# EAGLE schematic firefly-instrument-tray (EAGLE 7.7.0)

## Sheet 1 of 2
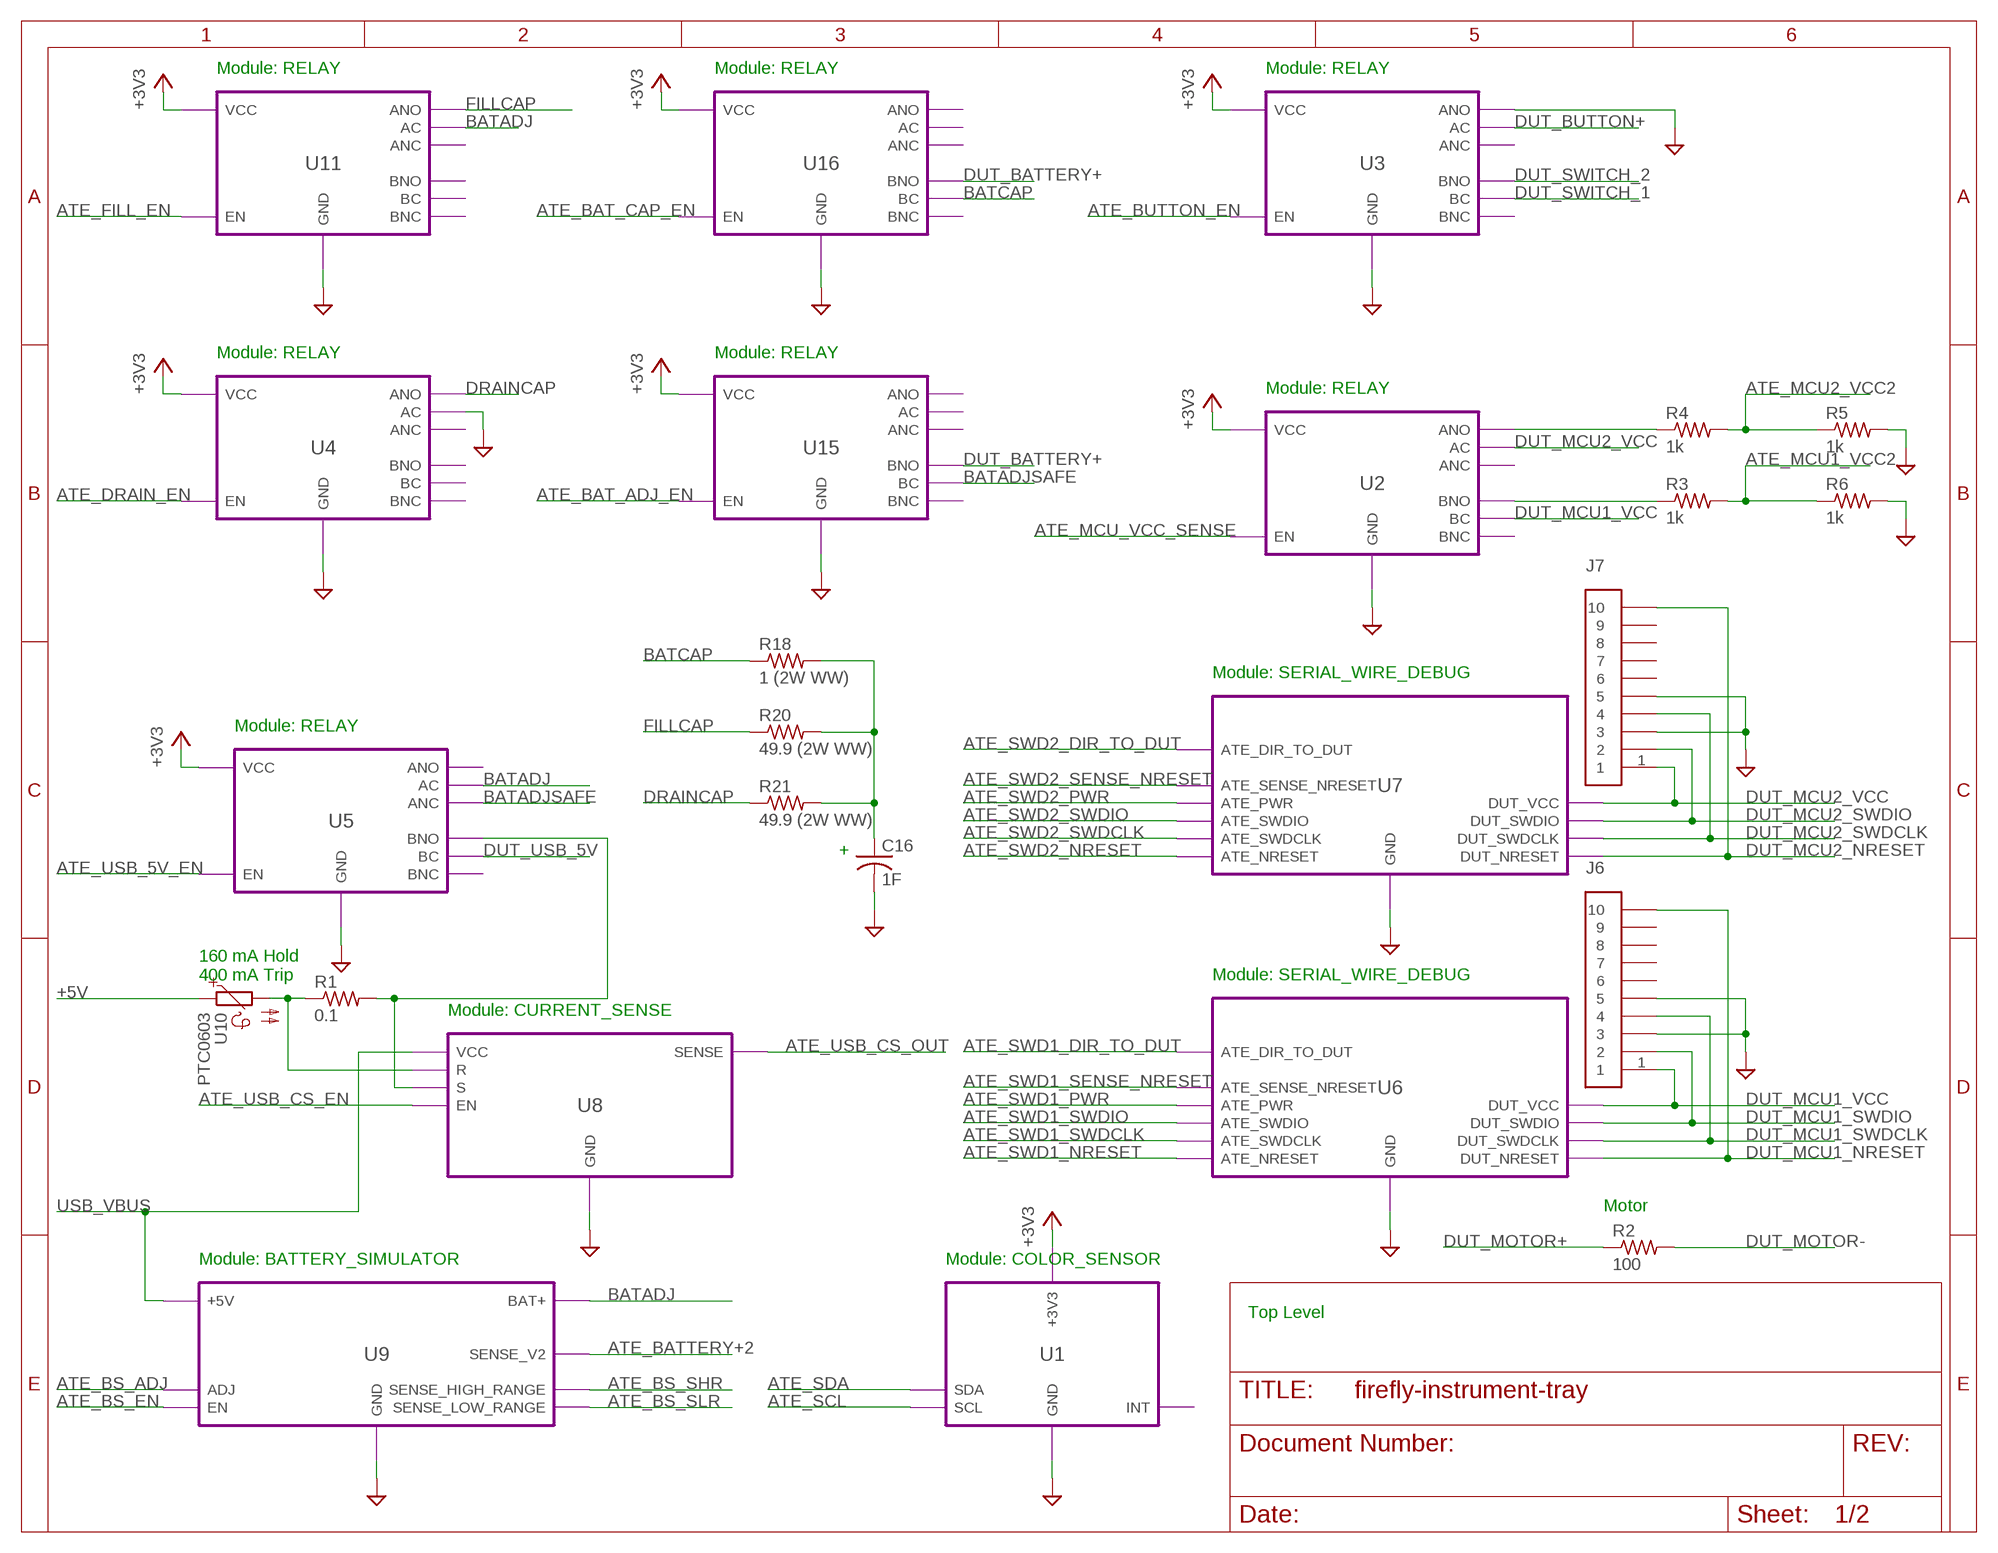
[diagram p0: schematic, sheet 1]

### Parts
C16  1F  C-USPM118  [PM118]
J6  CON-10SWD  [SWD-10]
J7  CON-10SWD  [SWD-10]
R1  0.1  R-USKRL6432  [KRL6432]
R2  100  R-USRW0S6BB  [RW0S6BB]
R3  1k  R-USR0805  [R0805]
R4  1k  R-USR0805  [R0805]
R5  1k  R-USR0805  [R0805]
R6  1k  R-USR0805  [R0805]
R18  1 (2W WW)  R-USRCL1225  [RCL1225]
R20  49.9 (2W WW)  R-USKRL6432  [KRL6432]
R21  49.9 (2W WW)  R-USRCL1225  [RCL1225]
U10  PTC0603  [0603]

### Module instances
U6 = SERIAL_WIRE_DEBUG
U8 = CURRENT_SENSE
U3 = RELAY
U5 = RELAY
U4 = RELAY
U9 = BATTERY_SIMULATOR
U7 = SERIAL_WIRE_DEBUG
U1 = COLOR_SENSOR
U2 = RELAY
U11 = RELAY
U15 = RELAY
U16 = RELAY

### Nets
+3V3: port U3.VCC U5.VCC U4.VCC U1.+3V3 U2.VCC U11.VCC U15.VCC U16.VCC ; also sheet 2
+5V: U10.1 ; also sheet 2
ATE_BAT_ADJ_EN: port U15.EN ; also sheet 2
ATE_BAT_CAP_EN: port U16.EN ; also sheet 2
ATE_BATTERY+2: port U9.SENSE_V2 ; also sheet 2
ATE_BS_ADJ: port U9.ADJ ; also sheet 2
ATE_BS_EN: port U9.EN ; also sheet 2
ATE_BS_SHR: port U9.SENSE_HIGH_RANGE ; also sheet 2
ATE_BS_SLR: port U9.SENSE_LOW_RANGE ; also sheet 2
ATE_BUTTON_EN: port U3.EN ; also sheet 2
ATE_DRAIN_EN: port U4.EN ; also sheet 2
ATE_FILL_EN: port U11.EN ; also sheet 2
ATE_MCU1_VCC2: R3.2 R6.1 ; also sheet 2
ATE_MCU2_VCC2: R4.2 R5.1 ; also sheet 2
ATE_MCU_VCC_SENSE: port U2.EN ; also sheet 2
ATE_SCL: port U1.SCL ; also sheet 2
ATE_SDA: port U1.SDA ; also sheet 2
ATE_SWD1_DIR_TO_DUT: port U6.ATE_DIR_TO_DUT ; also sheet 2
ATE_SWD1_NRESET: port U6.ATE_NRESET ; also sheet 2
ATE_SWD1_PWR: port U6.ATE_PWR ; also sheet 2
ATE_SWD1_SENSE_NRESET: port U6.ATE_SENSE_NRESET ; also sheet 2
ATE_SWD1_SWDCLK: port U6.ATE_SWDCLK ; also sheet 2
ATE_SWD1_SWDIO: port U6.ATE_SWDIO ; also sheet 2
ATE_SWD2_DIR_TO_DUT: port U7.ATE_DIR_TO_DUT ; also sheet 2
ATE_SWD2_NRESET: port U7.ATE_NRESET ; also sheet 2
ATE_SWD2_PWR: port U7.ATE_PWR ; also sheet 2
ATE_SWD2_SENSE_NRESET: port U7.ATE_SENSE_NRESET ; also sheet 2
ATE_SWD2_SWDCLK: port U7.ATE_SWDCLK ; also sheet 2
ATE_SWD2_SWDIO: port U7.ATE_SWDIO ; also sheet 2
ATE_USB_5V_EN: port U5.EN ; also sheet 2
ATE_USB_CS_EN: port U8.EN ; also sheet 2
ATE_USB_CS_OUT: port U8.SENSE ; also sheet 2
BATADJ: port U9.BAT+ U5.AC U11.AC
BATADJSAFE: port U5.ANC U15.BC
BATCAP: R18.1 ; port U16.BC
DRAINCAP: R21.1 ; port U4.ANO
DUT_BATTERY+: port U15.BNO U16.BNO ; also sheet 2
DUT_BUTTON+: port U3.AC ; also sheet 2
DUT_MCU1_NRESET: J6.10 ; port U6.DUT_NRESET ; also sheet 2
DUT_MCU1_SWDCLK: J6.4 ; port U6.DUT_SWDCLK ; also sheet 2
DUT_MCU1_SWDIO: J6.2 ; port U6.DUT_SWDIO ; also sheet 2
DUT_MCU1_VCC: J6.1 ; port U6.DUT_VCC U2.BC ; also sheet 2
DUT_MCU2_NRESET: J7.10 ; port U7.DUT_NRESET ; also sheet 2
DUT_MCU2_SWDCLK: J7.4 ; port U7.DUT_SWDCLK ; also sheet 2
DUT_MCU2_SWDIO: J7.2 ; port U7.DUT_SWDIO ; also sheet 2
DUT_MCU2_VCC: J7.1 ; port U7.DUT_VCC U2.AC ; also sheet 2
DUT_MOTOR+: R2.1 ; also sheet 2
DUT_MOTOR-: R2.2 ; also sheet 2
DUT_SWITCH_1: port U3.BC ; also sheet 2
DUT_SWITCH_2: port U3.BNO ; also sheet 2
DUT_USB_5V: port U5.BC ; also sheet 2
FILLCAP: R20.1 ; port U11.ANO
GND: C16.- J6.3 J6.5 J7.3 J7.5 R5.2 R6.2 ; port U5.GND U4.GND U3.GND U8.GND U9.GND U6.GND U7.GND U1.GND U2.GND U11.GND U15.GND U16.GND U4.AC U3.ANO ; also sheet 2
N$2: R1.2 ; port U5.BNO U8.S
N$3: R1.1 U10.2 ; port U8.R
N$4: C16.+ R18.2 R20.2 R21.2
N$8: R4.1 ; port U2.ANO
N$9: R3.1 ; port U2.BNO
USB_VBUS: port U9.+5V U8.VCC ; also sheet 2
Unconnected: J6.6 J6.7 J6.8 J6.9 J7.6 J7.7 J7.8 J7.9

### Notes on the sheet
- Module: RELAY | Module: RELAY | Module: RELAY
- Module: RELAY | Module: RELAY
- Module: RELAY
- Module: SERIAL_WIRE_DEBUG
- Module: RELAY
- +
- 160 mA Hold
  400 mA Trip
- Module: SERIAL_WIRE_DEBUG
- Module: CURRENT_SENSE
- Motor
- Module: BATTERY_SIMULATOR | Module: COLOR_SENSOR
- Top Level

## Sheet 2 of 2
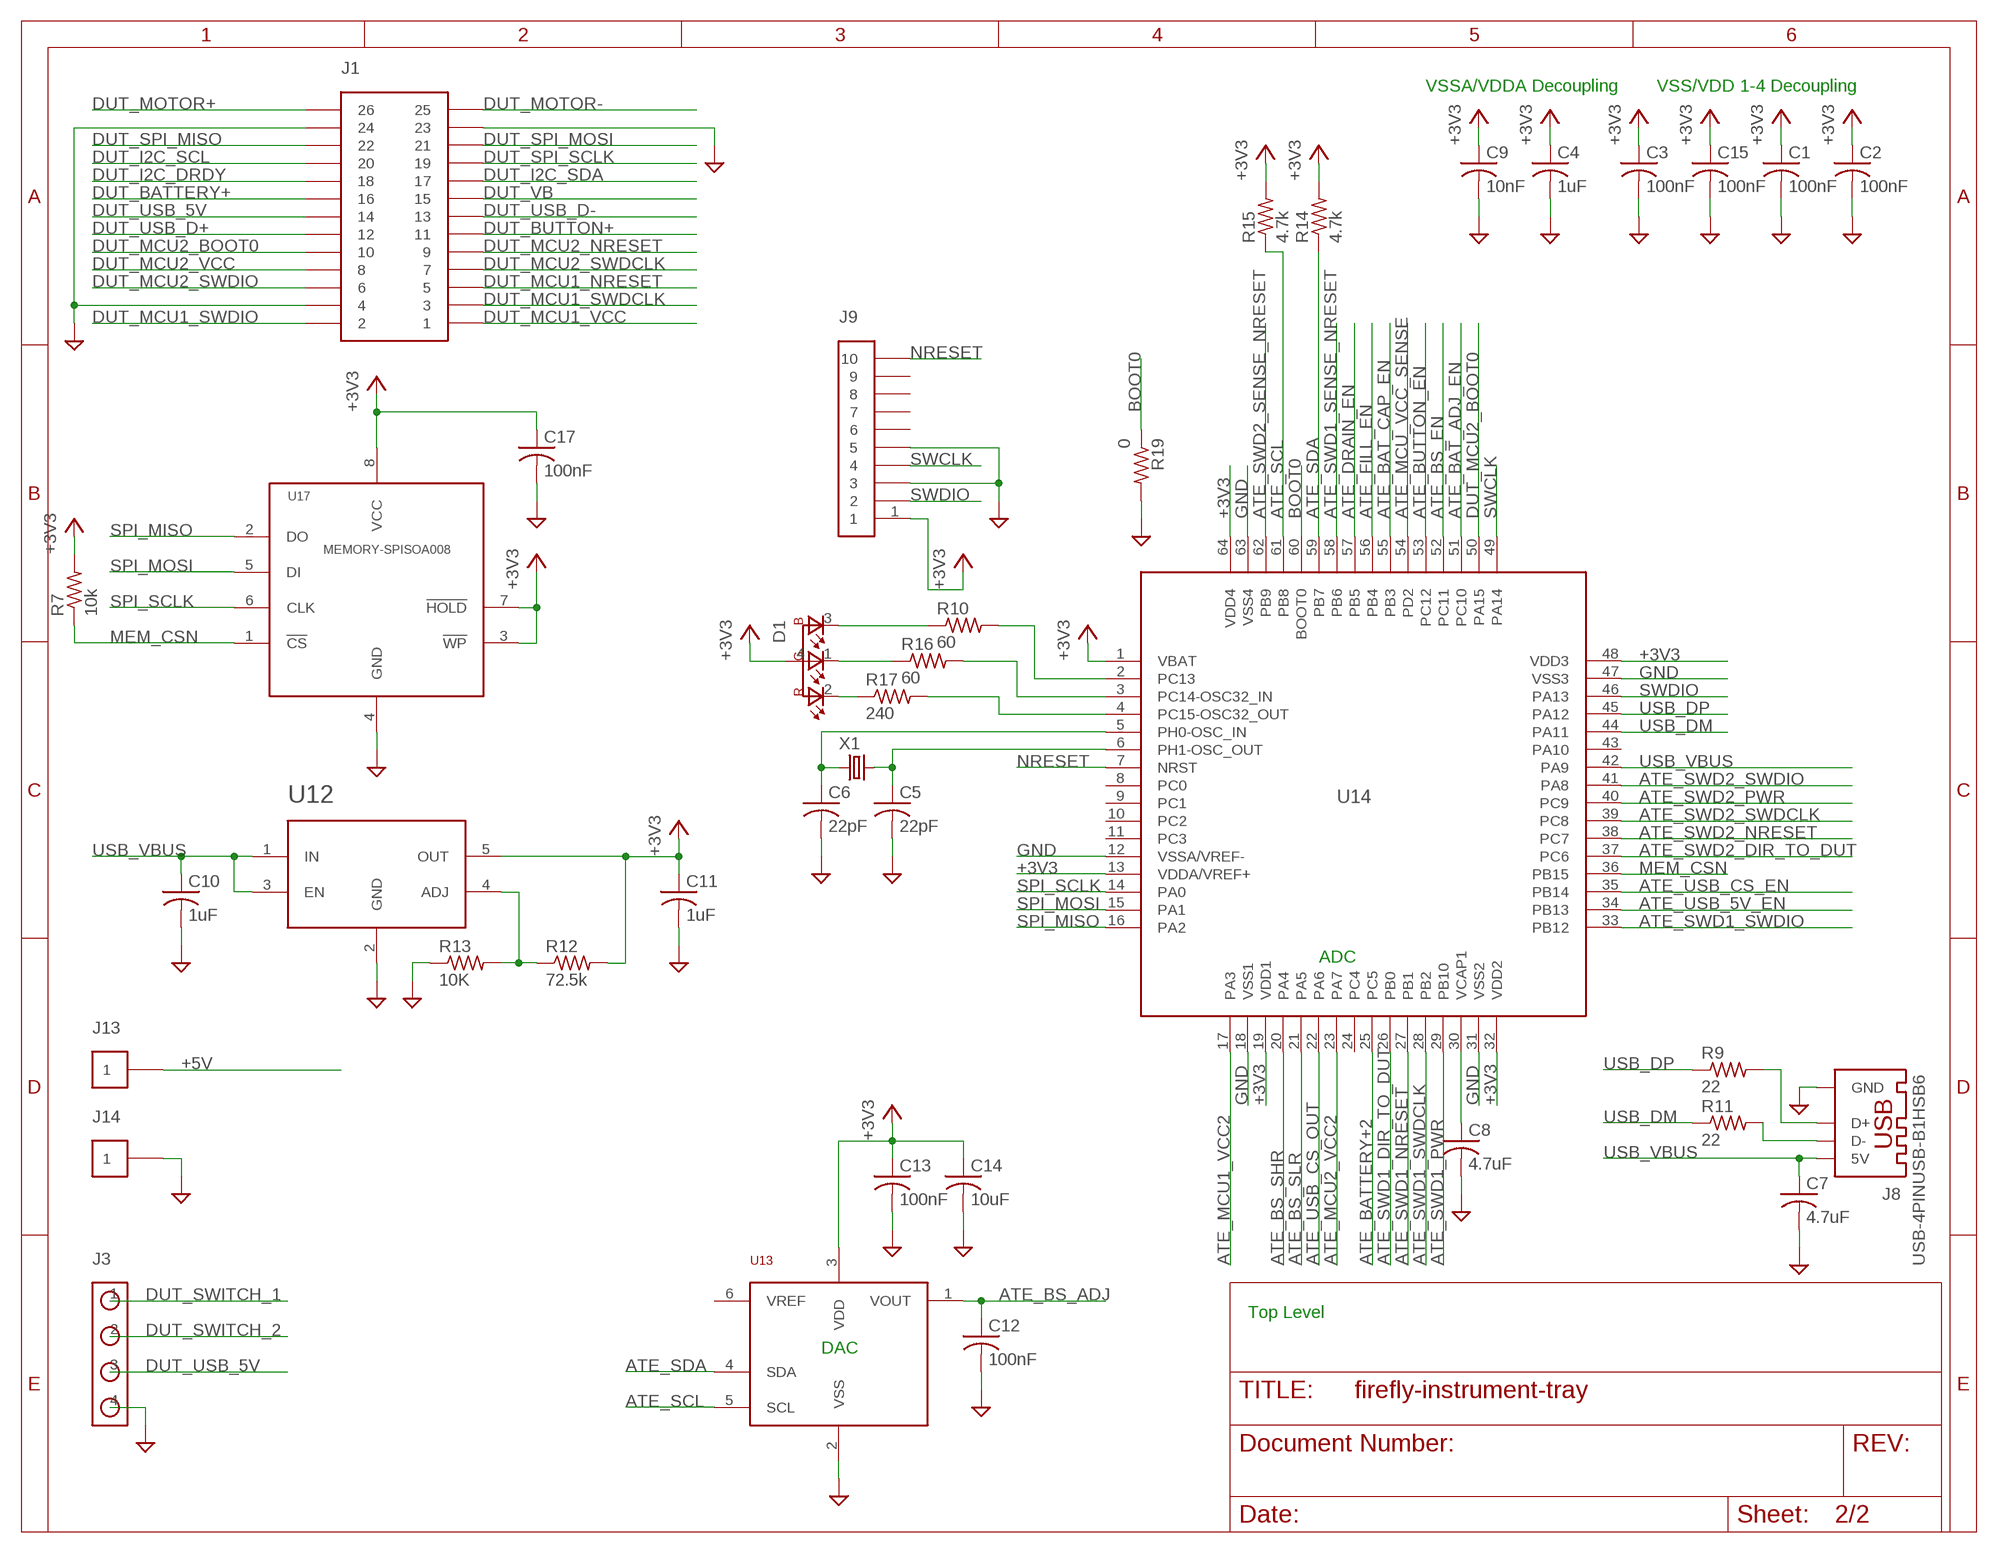
[diagram p1: schematic, sheet 2]

### Parts
C1  100nF  C-USC0805  [C0805]
C2  100nF  C-USC0805  [C0805]
C3  100nF  C-USC0805  [C0805]
C4  1uF  C-USC0805  [C0805]
C5  22pF  C-USC0805  [C0805]
C6  22pF  C-USC0805  [C0805]
C7  4.7uF  C-USC0805  [C0805]
C8  4.7uF  C-USC0805  [C0805]
C9  10nF  C-USC0805  [C0805]
C10  1uF  C-USC0805  [C0805]
C11  1uF  C-USC0805  [C0805]
C12  100nF  C-USC0805  [C0805]
C13  100nF  C-USC0805  [C0805]
C14  10uF  C-USC0805  [C0805]
C15  100nF  C-USC0805  [C0805]
C17  100nF  C-USC0805  [C0805]
D1  LED-RGB-CAMSL0201RGB  [MSL0201RGB]
J1  CON-26  [CON-HEADER-2X13]
J3  CON-4282847-4  [282847-4]
J8  USB-4PINUSB-B1HSB6  [USB-B1HSB6]
J9  CON-10SWD  [SWD-10]
J13  CON-1CT3151  [CT3151]
J14  CON-1CT3151  [CT3151]
R7  10k  R-USR0805  [R0805]
R9  22  R-USR0805  [R0805]
R10  60  R-USR0805  [R0805]
R11  22  R-USR0805  [R0805]
R12  72.5k  R-USR0805  [R0805]
R13  10K  R-USR0805  [R0805]
R14  4.7k  R-USR0805  [R0805]
R15  4.7k  R-USR0805  [R0805]
R16  60  R-USR0805  [R0805]
R17  240  R-USR0805  [R0805]
R19  0  R-USR0805  [R0805]
U12  VREG-ADJAP7331-WG-7  [SOT-23-5]
U13  MCP47X6  [SOT-23-6]
U14  STM32F411-LQFP64  [LQFP-64]
U17  MEMORY-SPISOA008  [SOA008]
X1  XTAL2CX5032GA  [CX5032GA]

### Nets
+3V3: C1.1 C2.1 C3.1 C4.1 C9.1 C11.1 C13.1 C14.1 C15.1 C17.1 D1.4(A) J9.1 R7.2 R12.2 R14.2 R15.2 U12.5(OUT) U13.3(VDD) U14.1(VBAT) U14.13(VDDA/VREF+) U14.19(VDD1) U14.32(VDD2) U14.48(VDD3) U14.64(VDD4) U17.3(!WP) U17.7(!HOLD) U17.8(VCC) ; also sheet 1
+5V: J13.1 J13.2 J13.3 J13.4 ; also sheet 1
ATE_BAT_ADJ_EN: U14.51(PC10) ; also sheet 1
ATE_BAT_CAP_EN: U14.55(PB3) ; also sheet 1
ATE_BATTERY+2: U14.25(PC5) ; also sheet 1
ATE_BS_ADJ: C12.1 U13.1(VOUT) ; also sheet 1
ATE_BS_EN: U14.52(PC11) ; also sheet 1
ATE_BS_SHR: U14.20(PA4) ; also sheet 1
ATE_BS_SLR: U14.21(PA5) ; also sheet 1
ATE_BUTTON_EN: U14.53(PC12) ; also sheet 1
ATE_DRAIN_EN: U14.57(PB5) ; also sheet 1
ATE_FILL_EN: U14.56(PB4) ; also sheet 1
ATE_MCU1_VCC2: U14.17(PA3) ; also sheet 1
ATE_MCU2_VCC2: U14.23(PA7) ; also sheet 1
ATE_MCU_VCC_SENSE: U14.54(PD2) ; also sheet 1
ATE_SCL: R15.1 U13.5(SCL) U14.61(PB8) ; also sheet 1
ATE_SDA: R14.1 U13.4(SDA) U14.59(PB7) ; also sheet 1
ATE_SWD1_DIR_TO_DUT: U14.26(PB0) ; also sheet 1
ATE_SWD1_NRESET: U14.27(PB1) ; also sheet 1
ATE_SWD1_PWR: U14.29(PB10) ; also sheet 1
ATE_SWD1_SENSE_NRESET: U14.58(PB6) ; also sheet 1
ATE_SWD1_SWDCLK: U14.28(PB2) ; also sheet 1
ATE_SWD1_SWDIO: U14.33(PB12) ; also sheet 1
ATE_SWD2_DIR_TO_DUT: U14.37(PC6) ; also sheet 1
ATE_SWD2_NRESET: U14.38(PC7) ; also sheet 1
ATE_SWD2_PWR: U14.40(PC9) ; also sheet 1
ATE_SWD2_SENSE_NRESET: U14.62(PB9) ; also sheet 1
ATE_SWD2_SWDCLK: U14.39(PC8) ; also sheet 1
ATE_SWD2_SWDIO: U14.41(PA8) ; also sheet 1
ATE_USB_5V_EN: U14.34(PB13) ; also sheet 1
ATE_USB_CS_EN: U14.35(PB14) ; also sheet 1
ATE_USB_CS_OUT: U14.22(PA6) ; also sheet 1
BOOT0: R19.1 U14.60(BOOT0)
DUT_BATTERY+: J1.16 ; also sheet 1
DUT_BUTTON+: J1.11 ; also sheet 1
DUT_I2C_DRDY: J1.18
DUT_I2C_SCL: J1.20
DUT_I2C_SDA: J1.17
DUT_MCU1_NRESET: J1.5 ; also sheet 1
DUT_MCU1_SWDCLK: J1.3 ; also sheet 1
DUT_MCU1_SWDIO: J1.2 ; also sheet 1
DUT_MCU1_VCC: J1.1 ; also sheet 1
DUT_MCU2_BOOT0: J1.10 U14.50(PA15)
DUT_MCU2_NRESET: J1.9 ; also sheet 1
DUT_MCU2_SWDCLK: J1.7 ; also sheet 1
DUT_MCU2_SWDIO: J1.6 ; also sheet 1
DUT_MCU2_VCC: J1.8 ; also sheet 1
DUT_MOTOR+: J1.26 ; also sheet 1
DUT_MOTOR-: J1.25 ; also sheet 1
DUT_SPI_MISO: J1.22
DUT_SPI_MOSI: J1.21
DUT_SPI_SCLK: J1.19
DUT_SWITCH_1: J3.1 ; also sheet 1
DUT_SWITCH_2: J3.2 ; also sheet 1
DUT_USB_5V: J1.14 J3.3 ; also sheet 1
DUT_USB_D+: J1.12
DUT_USB_D-: J1.13
DUT_VB: J1.15
GND: C1.2 C2.2 C3.2 C4.2 C5.2 C6.2 C7.2 C8.2 C9.2 C10.2 C11.2 C12.2 C13.2 C14.2 C15.2 C17.2 J1.4 J1.23 J1.24 J3.4 J8.4(GND) J9.3 J9.5 J14.1 J14.2 J14.3 J14.4 R13.1 R19.2 U12.2(GND) U13.2(VSS) U14.12(VSSA/VREF-) U14.18(VSS1) U14.31(VSS2) U14.47(VSS3) U14.63(VSS4) U17.4(GND) ; also sheet 1
MEM_CSN: R7.1 U14.36(PB15) U17.1(!CS)
N$1: R10.2 U14.2(PC13)
N$5: C5.1 U14.6(PH1-OSC_OUT) X1.2
N$6: C6.1 U14.5(PH0-OSC_IN) X1.1
N$7: R16.2 U14.3(PC14-OSC32_IN)
N$10: C8.1 U14.30(VCAP1)
N$11: R12.1 R13.2 U12.4(ADJ)
N$12: J8.2(D-) R11.2
N$13: R17.2 U14.4(PC15-OSC32_OUT)
N$14: J8.3(D+) R9.2
N$15: D1.3(B) R10.1
N$16: D1.1(G) R16.1
N$17: D1.2(R) R17.1
NRESET: J9.10 U14.7(NRST)
SPI_MISO: U14.16(PA2) U17.2(DO)
SPI_MOSI: U14.15(PA1) U17.5(DI)
SPI_SCLK: U14.14(PA0) U17.6(CLK)
SWCLK: J9.4 U14.49(PA14)
SWDIO: J9.2 U14.46(PA13)
USB_DM: R11.1 U14.44(PA11)
USB_DP: R9.1 U14.45(PA12)
USB_VBUS: C7.1 C10.1 J8.1(5V) U12.1(IN) U12.3(EN) U14.42(PA9) ; also sheet 1
Unconnected: J9.6 J9.7 J9.8 J9.9 U13.6(VREF) U14.8(PC0) U14.9(PC1) U14.10(PC2) U14.11(PC3) U14.24(PC4) U14.43(PA10)

### Notes on the sheet
- VSSA/VDDA Decoupling | VSS/VDD 1-4 Decoupling
- ADC
- Top Level
- DAC

## Library data of the parts
C1-C3 C12 C13 C15 C17 = firefly:C-US: CAPACITOR, American symbol; MANUFACTURER: AVX Corporation; ORDERING-CODE: 08055C104KAT2A
C4 C10 C11 = firefly:C-US: CAPACITOR, American symbol; MANUFACTURER: Yageo; ORDERING-CODE: CC0805KKX7R7BB105
C5 C6 = firefly:C-US: CAPACITOR, American symbol; MANUFACTURER: KEMET; ORDERING-CODE: C0805C220F5GACTU
C7 C8 = firefly:C-US: CAPACITOR, American symbol; MANUFACTURER: Murata Electronics North America; ORDERING-CODE: GRM21BR61E475KA12L
C9 = firefly:C-US: CAPACITOR, American symbol; MANUFACTURER: AVX Corporation; ORDERING-CODE: 08055C103KAT2A
C14 = firefly:C-US: CAPACITOR, American symbol; MANUFACTURER: AVX Corporation; ORDERING-CODE: 0805YD106KAT2A
C16 = firefly:C-US: CAPACITOR, American symbol; MANUFACTURER: Eaton; ORDERING-CODE: PM-5R0V105-R
D1 = firefly:LED-RGB-CA; MANUFACTURER: Rohm Semiconductor; ORDERING-CODE: MSL0201RGBW1
J1 = firefly:CON-26; MANUFACTURER: Amphenol FCI; ORDERING-CODE: 68602-126HLF
J3 = firefly:CON-4; MANUFACTURER: TE Connectivity AMP Connectors; ORDERING-CODE: 282847-4
J6 J7 = firefly:CON-10; MANUFACTURER: Harwin; ORDERING-CODE: M50-3500542
J8 = firefly:USB-4PIN; MANUFACTURER: On Shore Technology Inc.; ORDERING-CODE: USB-B1HSB6
J9 = firefly:CON-10; MAUFACTURER: Harwin; ORDERING-CODE: M50-3500542
J13 = firefly:CON-1; MANUFACTURER: B&K Precision; ORDERING-CODE: CT3151-2
J14 = firefly:CON-1; MANUFACTURER: B&K Precision; ORDERING-CODE: CT3151SP-0
R1 = firefly:R-US: RESISTOR, American symbol; MANUFACTURER: Susumu; ORDERING-CODE: KRL6432E-M-R100-F-T1
R2 = firefly:R-US: RESISTOR, American symbol; MANUFACTURER: Ohmite; ORDERING-CODE: RW0S6BB100RFET
R3-R7 R13 = firefly:R-US: RESISTOR, American symbol; MANUFACTURER: Yageo; ORDERING-CODE: RC0805FR-0710KL
R9 R11 = firefly:R-US: RESISTOR, American symbol; MANUFACTURER: Yageo; ORDERING-CODE: RC0805FR-0722RL
R10 R16 = firefly:R-US: RESISTOR, American symbol; MANUFACTURER: Yageo; ORDERING-CODE: RC0805FR-0760R4L
R12 = firefly:R-US: RESISTOR, American symbol; MANUFACTURER: Yageo; ORDERING-CODE: RT0805BRD0773K2L
R14 R15 = firefly:R-US: RESISTOR, American symbol; MANUFACTURER: Yageo; ORDERING-CODE: RC0805FR-074K7L
R17 = firefly:R-US: RESISTOR, American symbol; MANUFACTURER: Yageo; ORDERING-CODE: RC0805FR-07240RL
R18 = firefly:R-US: RESISTOR, American symbol; MANUFACTURER: Vishay Dale; ORDERING-CODE: RCL12251R00FKEG
R19 = firefly:R-US: RESISTOR, American symbol; MANUFACTURER: Yageo; ORDERING-CODE: RC0805FR-070RL
R20 R21 = firefly:R-US: RESISTOR, American symbol; MANUFACTURER: Vishay Dale; ORDERING-CODE: RCL122549R9FKEG
U10 = firefly:PTC; MANUFACTURER: Bel Fuse Inc.; ORDERING-CODE: 0ZCM0016FF2G
U12 = firefly:VREG-ADJ; MANUFACTURER: Diodes Incorporated; ORDERING-CODE: AP7331-WG-7
U13 = firefly:MCP47X6; MANUFACTURER: Microchip Technology; ORDERING-CODE: MCP4726A1T-E/CH
U14 = firefly:STM32F411-LQFP64; MANUFACTURER: STMicroelectronics; ORDERING-CODE: STM32F411RET6
U17 = firefly:MEMORY-SPI; MANUFACTURER: Cypress Semiconductor Corp; ORDERING-CODE: S25FL116K0XMFI043
X1 = firefly:XTAL2; MANUFACTURER: AVX Corp/Kyocera Corp; ORDERING-CODE: CX5032GA08000H0PST02

## Module SERIAL_WIRE_DEBUG
Ports: GND(io) ATE_NRESET(io) ATE_SWDCLK(io) ATE_SWDIO(io) ATE_PWR(io) ATE_DIR_TO_DUT(io) DUT_NRESET(io) DUT_SWDCLK(io) DUT_SWDIO(io) DUT_VCC(io) ATE_SENSE_NRESET(io)
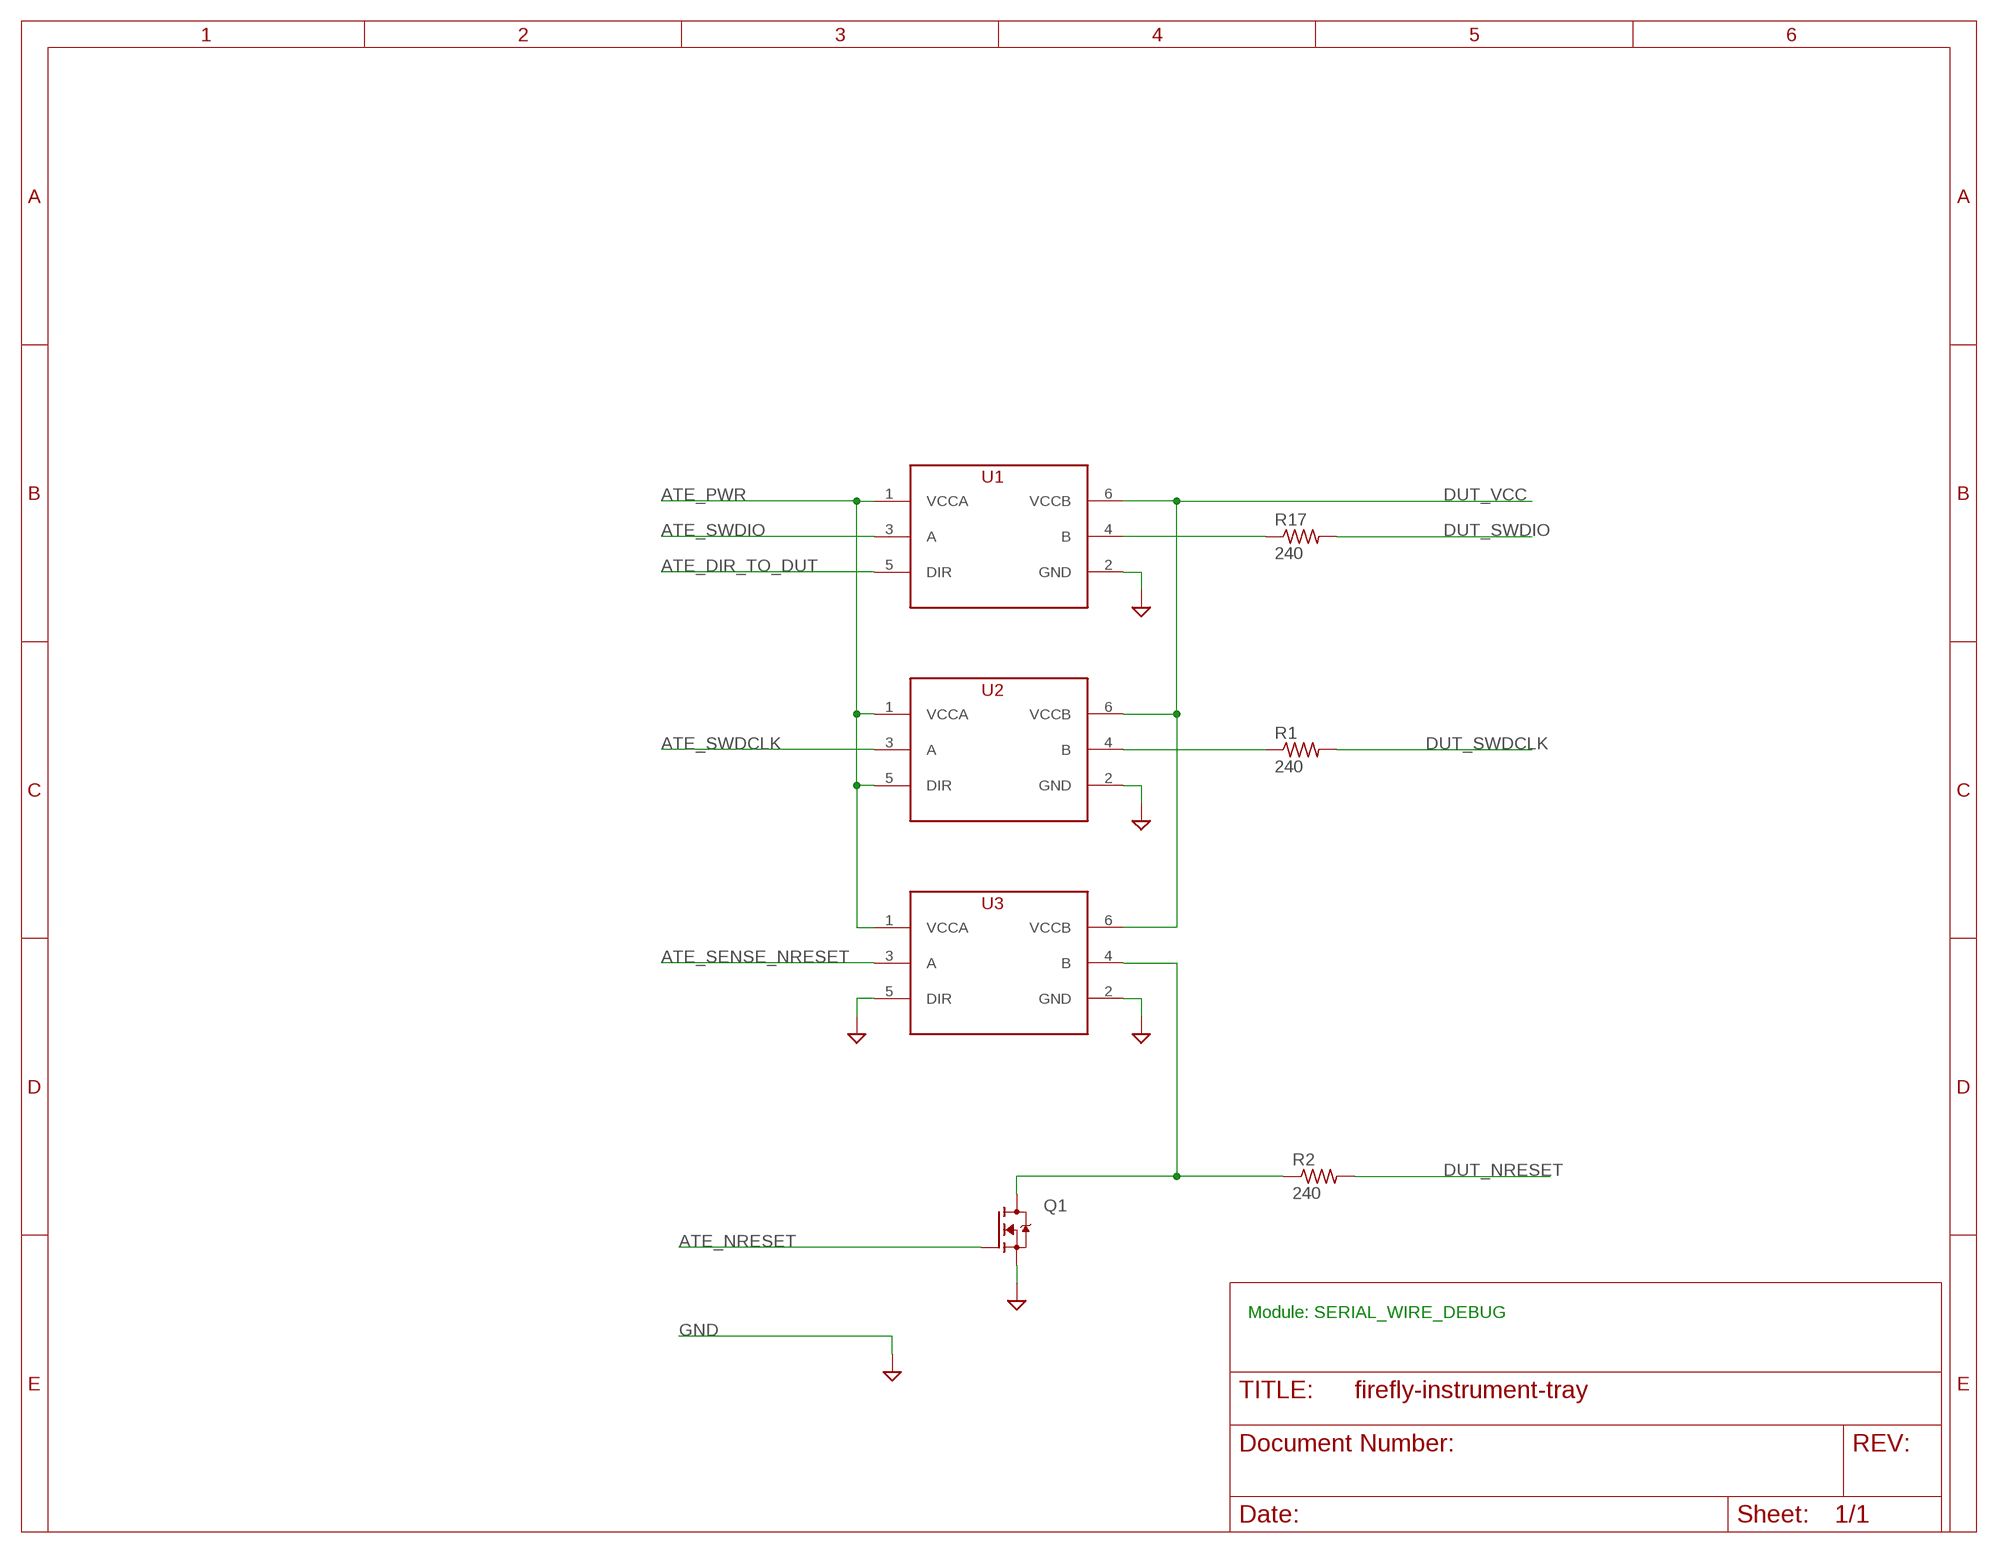
[diagram p2: schematic, module SERIAL_WIRE_DEBUG, sheet 1]

### Parts
Q1  FET-NMCPH3  [MCPH3]
R1  240  R-USR0805  [R0805]
R2  240  R-USR0805  [R0805]
R17  240  R-USR0805  [R0805]
U1  74LVCH1T45  [SOT363]
U2  74LVCH1T45  [SOT363]
U3  74LVCH1T45  [SOT363]

### Nets
ATE_DIR_TO_DUT: U1.5(DIR)
ATE_NRESET: Q1.1(G)
ATE_PWR: U1.1(VCCA) U2.1(VCCA) U2.5(DIR) U3.1(VCCA)
ATE_SENSE_NRESET: U3.3(A)
ATE_SWDCLK: U2.3(A)
ATE_SWDIO: U1.3(A)
DUT_NRESET: R2.2
DUT_SWDCLK: R1.2
DUT_SWDIO: R17.2
DUT_VCC: U1.6(VCCB) U2.6(VCCB) U3.6(VCCB)
GND: Q1.2(S) U1.2(GND) U2.2(GND) U3.2(GND) U3.5(DIR)
N$1: Q1.3(D) R2.1 U3.4(B)
N$2: R17.1 U1.4(B)
N$3: R1.1 U2.4(B)

### Notes on the sheet
- Module: SERIAL_WIRE_DEBUG

### Library data of the parts
Q1 = firefly:FET-N; MANUFACTURER: ON Semiconductor; ORDERING-CODE: MCH3481-TL-W
R1 R2 R17 = firefly:R-US: RESISTOR, American symbol; MANUFACTURER: Yageo; ORDERING-CODE: RC0805FR-07240RL
U1-U3 = firefly:74LVCH1T45; MANUFACTURER: NXP Semiconductors; ORDERING-CODE: 74LVCH1T45GW,125

## Module RELAY
Ports: GND(io) VCC(io) ANO(io) AC(io) ANC(io) BNO(io) BC(io) BNC(io) EN(io)
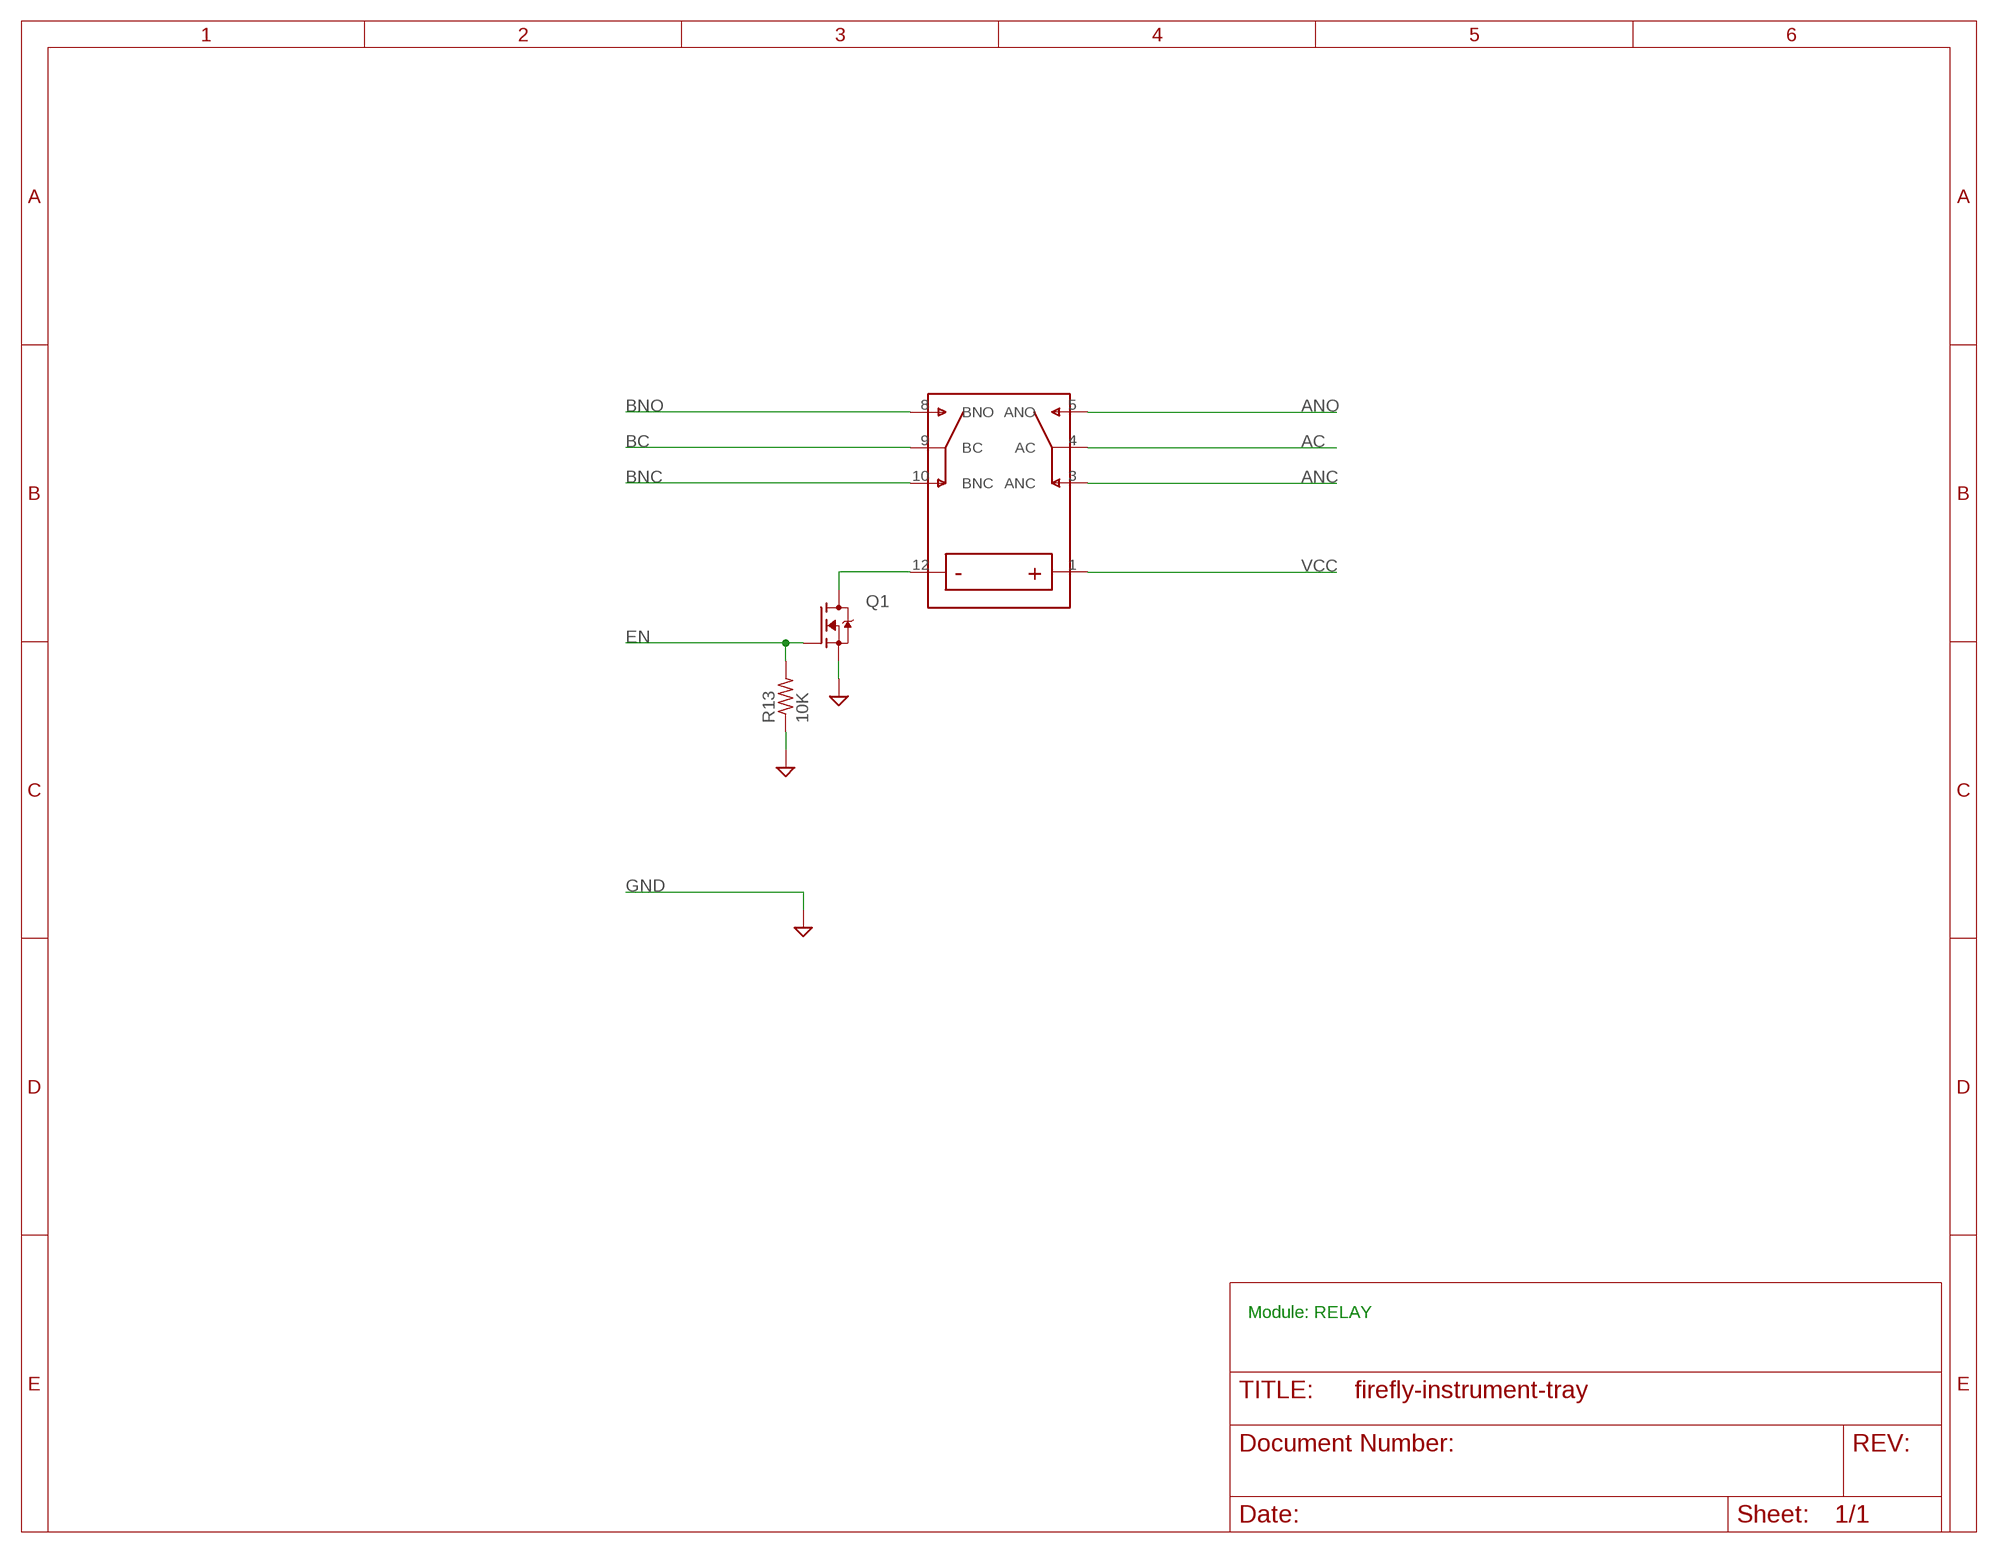
[diagram p3: schematic, module RELAY, sheet 1]

### Parts
Q1  FET-NMCPH3  [MCPH3]
R13  10K  R-USR0805  [R0805]
U1  TXS2SA  [TXS2SA]

### Nets
AC: U1.4(AC)
ANC: U1.3(ANC)
ANO: U1.5(ANO)
BC: U1.9(BC)
BNC: U1.10(BNC)
BNO: U1.8(BNO)
EN: Q1.1(G) R13.2
GND: Q1.2(S) R13.1
N$2: Q1.3(D) U1.12(-)
VCC: U1.1(+)

### Notes on the sheet
- Module: RELAY

### Library data of the parts
Q1 = firefly:FET-N; MANUFACTURER: ON Semiconductor; ORDERING-CODE: MCH3481-TL-W
R13 = firefly:R-US: RESISTOR, American symbol; MANUFACTURER: Yageo; ORDERING-CODE: RC0805FR-0710KL
U1 = firefly:TXS2SA; MANUFACTURER: Panasonic Electric Works; ORDERING-CODE: TXS2SA-3V-Z

## Module CURRENT_SENSE
Ports: GND(io) VCC(io) R(io) S(io) EN(io) SENSE(io)
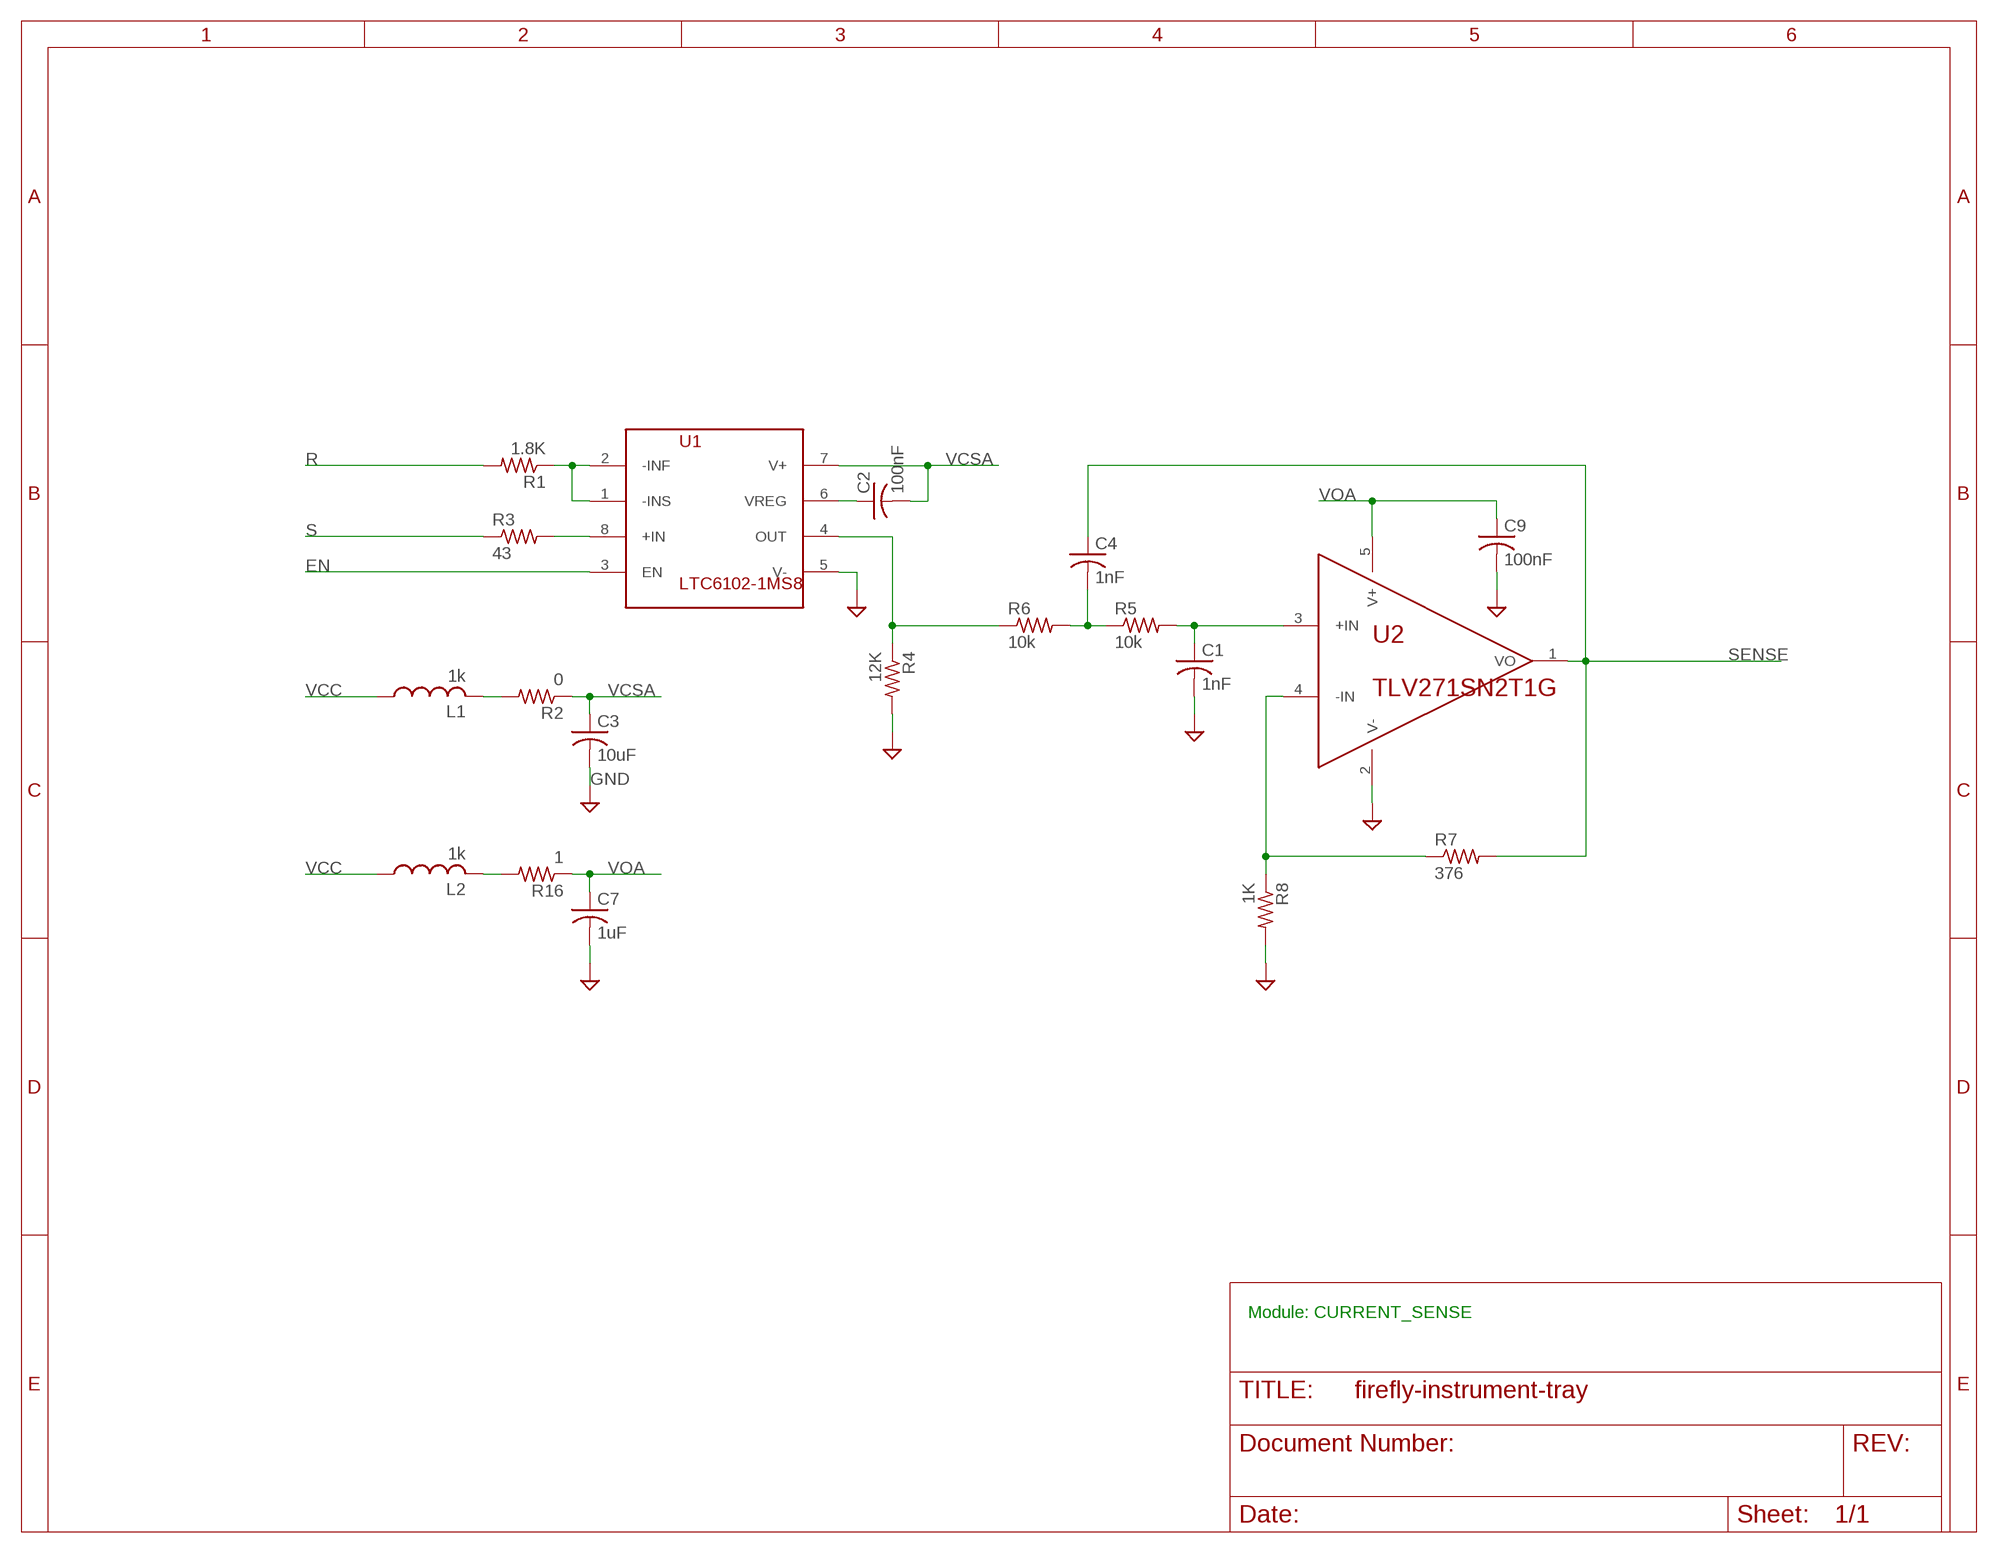
[diagram p4: schematic, module CURRENT_SENSE, sheet 1]

### Parts
C1  1nF  C-USC0805  [C0805]
C2  100nF  C-USC0805  [C0805]
C3  10uF  C-USC0805  [C0805]
C4  1nF  C-USC0805  [C0805]
C7  1uF  C-USC0805  [C0805]
C9  100nF  C-USC0805  [C0805]
L1  1k  L-USL2012C  [L2012C]
L2  1k  L-USL2012C  [L2012C]
R1  1.8K  R-USR0805  [R0805]
R2  0  R-USR0805  [R0805]
R3  43  R-USR0805  [R0805]
R4  12K  R-USR0805  [R0805]
R5  10k  R-USR0805  [R0805]
R6  10k  R-USR0805  [R0805]
R7  376  R-USR0805  [R0805]
R8  1K  R-USR0805  [R0805]
R16  1  R-USR0805  [R0805]
U1  LTC6102-1MS8  [MSOP8]
U2  TLV271SN2T1G  [SOT-23-5]

### Nets
EN: U1.3(EN)
GND: C1.2 C3.2 C7.2 C9.2 R4.2 R8.2 U1.5(V-) U2.2(V-)
N$1: L1.2 R2.2
N$2: L2.2 R16.2
N$3: C2.1 U1.6(VREG)
N$4: R1.1 U1.1(-INS) U1.2(-INF)
N$7: R3.2 U1.8(+IN)
N$9: R4.1 R6.1 U1.4(OUT)
N$10: C4.2 R5.1 R6.2
N$11: C1.1 R5.2 U2.3(+IN)
N$12: R7.1 R8.1 U2.4(-IN)
R: R1.2
S: R3.1
SENSE: C4.1 R7.2 U2.1(VO)
VCC: L1.1 L2.1
VCSA: C2.2 C3.1 R2.1 U1.7(V+)
VOA: C7.1 C9.1 R16.1 U2.5(V+)

### Notes on the sheet
- Module: CURRENT_SENSE

### Library data of the parts
C1 C4 = firefly:C-US: CAPACITOR, American symbol; MANUFACTURER: AVX Corporation; ORDERING-CODE: 08055A102JAT2A
C2 C9 = firefly:C-US: CAPACITOR, American symbol; MANUFACTURER: AVX Corporation; ORDERING-CODE: 08055C104KAT2A
C3 = firefly:C-US: CAPACITOR, American symbol; MANUFACTURER: AVX Corporation; ORDERING-CODE: 0805YD106KAT2A
C7 = firefly:C-US: CAPACITOR, American symbol; MANUFACTURER: Yageo; ORDERING-CODE: CC0805KKX7R7BB105
L1 L2 = firefly:L-US: INDUCTOR, American symbol; MANUFACTURER: Murata Electronics; ORDERING-CODE: BLM21BD102SN1D
R1 = firefly:R-US: RESISTOR, American symbol; MANUFACTURER: Yageo; ORDERING-CODE: RC0805FR-071K8L
R2 = firefly:R-US: RESISTOR, American symbol; MANUFACTURER: Yageo; ORDERING-CODE: RC0805FR-070RL
R3 = firefly:R-US: RESISTOR, American symbol; MANUFACTURER: Yageo; ORDERING-CODE: RC0805FR-0743RL
R4 = firefly:R-US: RESISTOR, American symbol; MANUFACTURER: Yageo; ORDERING-CODE: RC0805FR-0712KL
R5 R6 = firefly:R-US: RESISTOR, American symbol; MANUFACTURER: Yageo; ORDERING-CODE: RC0805FR-0710KL
R7 = firefly:R-US: RESISTOR, American symbol; MANUFACTURER: Yageo; ORDERING-CODE: RC0805FR-07374RL
R8 = firefly:R-US: RESISTOR, American symbol; MANUFACTURER: Yageo; ORDERING-CODE: RC0805FR-071KL
R16 = firefly:R-US: RESISTOR, American symbol; MANUFACTURER: Yageo; ORDERING-CODE: RC0805FR-071RL
U1 = firefly:LTC6102-1; MANUFACTURER: Linear Technology; ORDERING-CODE: LTC6102CMS8-1#PBF
U2 = firefly:TLV271SN2T1G; MANUFACTURER: ON Semiconductor; ORDERING-CODE: TLV271SN2T1G

## Module BATTERY_SIMULATOR
Ports: GND(io) +5V(io) ADJ(io) EN(io) BAT+(io) SENSE_HIGH_RANGE(io) SENSE_LOW_RANGE(io) SENSE_V2(io)

### Sheet 1 of 2
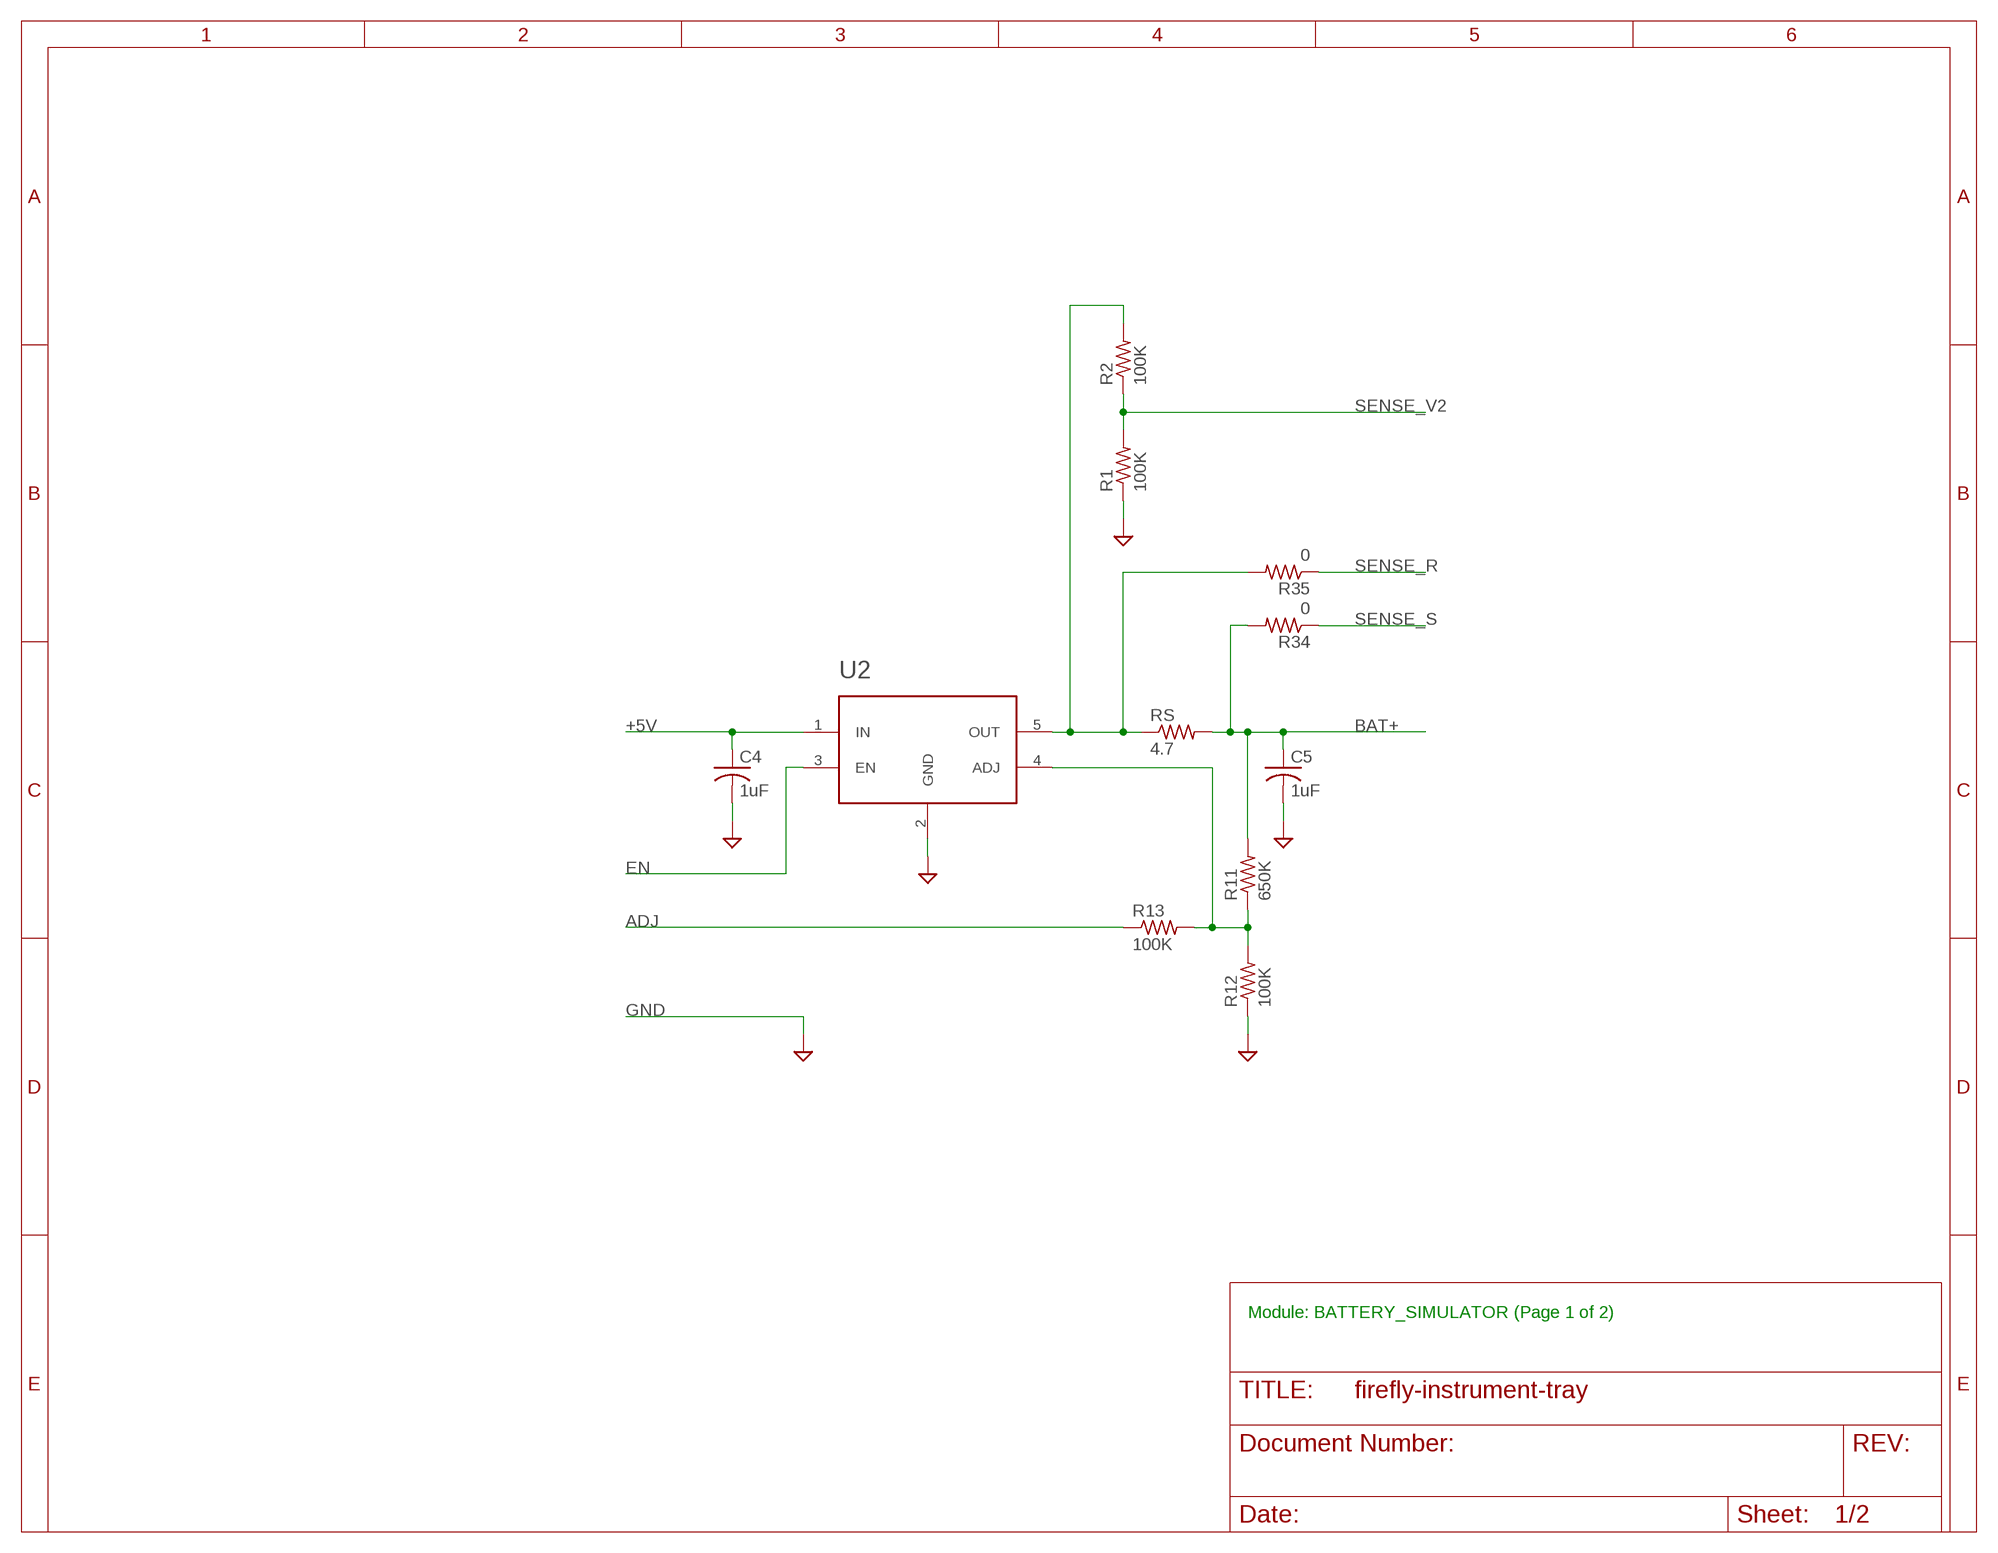
[diagram p5: schematic, module BATTERY_SIMULATOR, sheet 1]

#### Parts
C4  1uF  C-USC0805  [C0805]
C5  1uF  C-USC0805  [C0805]
R1  100K  R-USR0805  [R0805]
R2  100K  R-USR0805  [R0805]
R11  650K  R-USR0805  [R0805]
R12  100K  R-USR0805  [R0805]
R13  100K  R-USR0805  [R0805]
R34  0  R-USR0805  [R0805]
R35  0  R-USR0805  [R0805]
RS  4.7  R-USR0805  [R0805]
U2  VREG-ADJAP7331-WG-7  [SOT-23-5]

#### Nets
+5V: C4.1 U2.1(IN) ; also sheet 2
ADJ: R13.1
BAT+: C5.1 R11.2 R34.2 RS.2
EN: U2.3(EN) ; also sheet 2
GND: C4.2 C5.2 R1.1 R12.1 U2.2(GND) ; also sheet 2
N$4: R11.1 R12.2 R13.2 U2.4(ADJ)
N$35: R2.2 R35.2 RS.1 U2.5(OUT)
SENSE_R: R35.1 ; also sheet 2
SENSE_S: R34.1 ; also sheet 2
SENSE_V2: R1.2 R2.1

#### Notes on the sheet
- Module: BATTERY_SIMULATOR (Page 1 of 2)

### Sheet 2 of 2
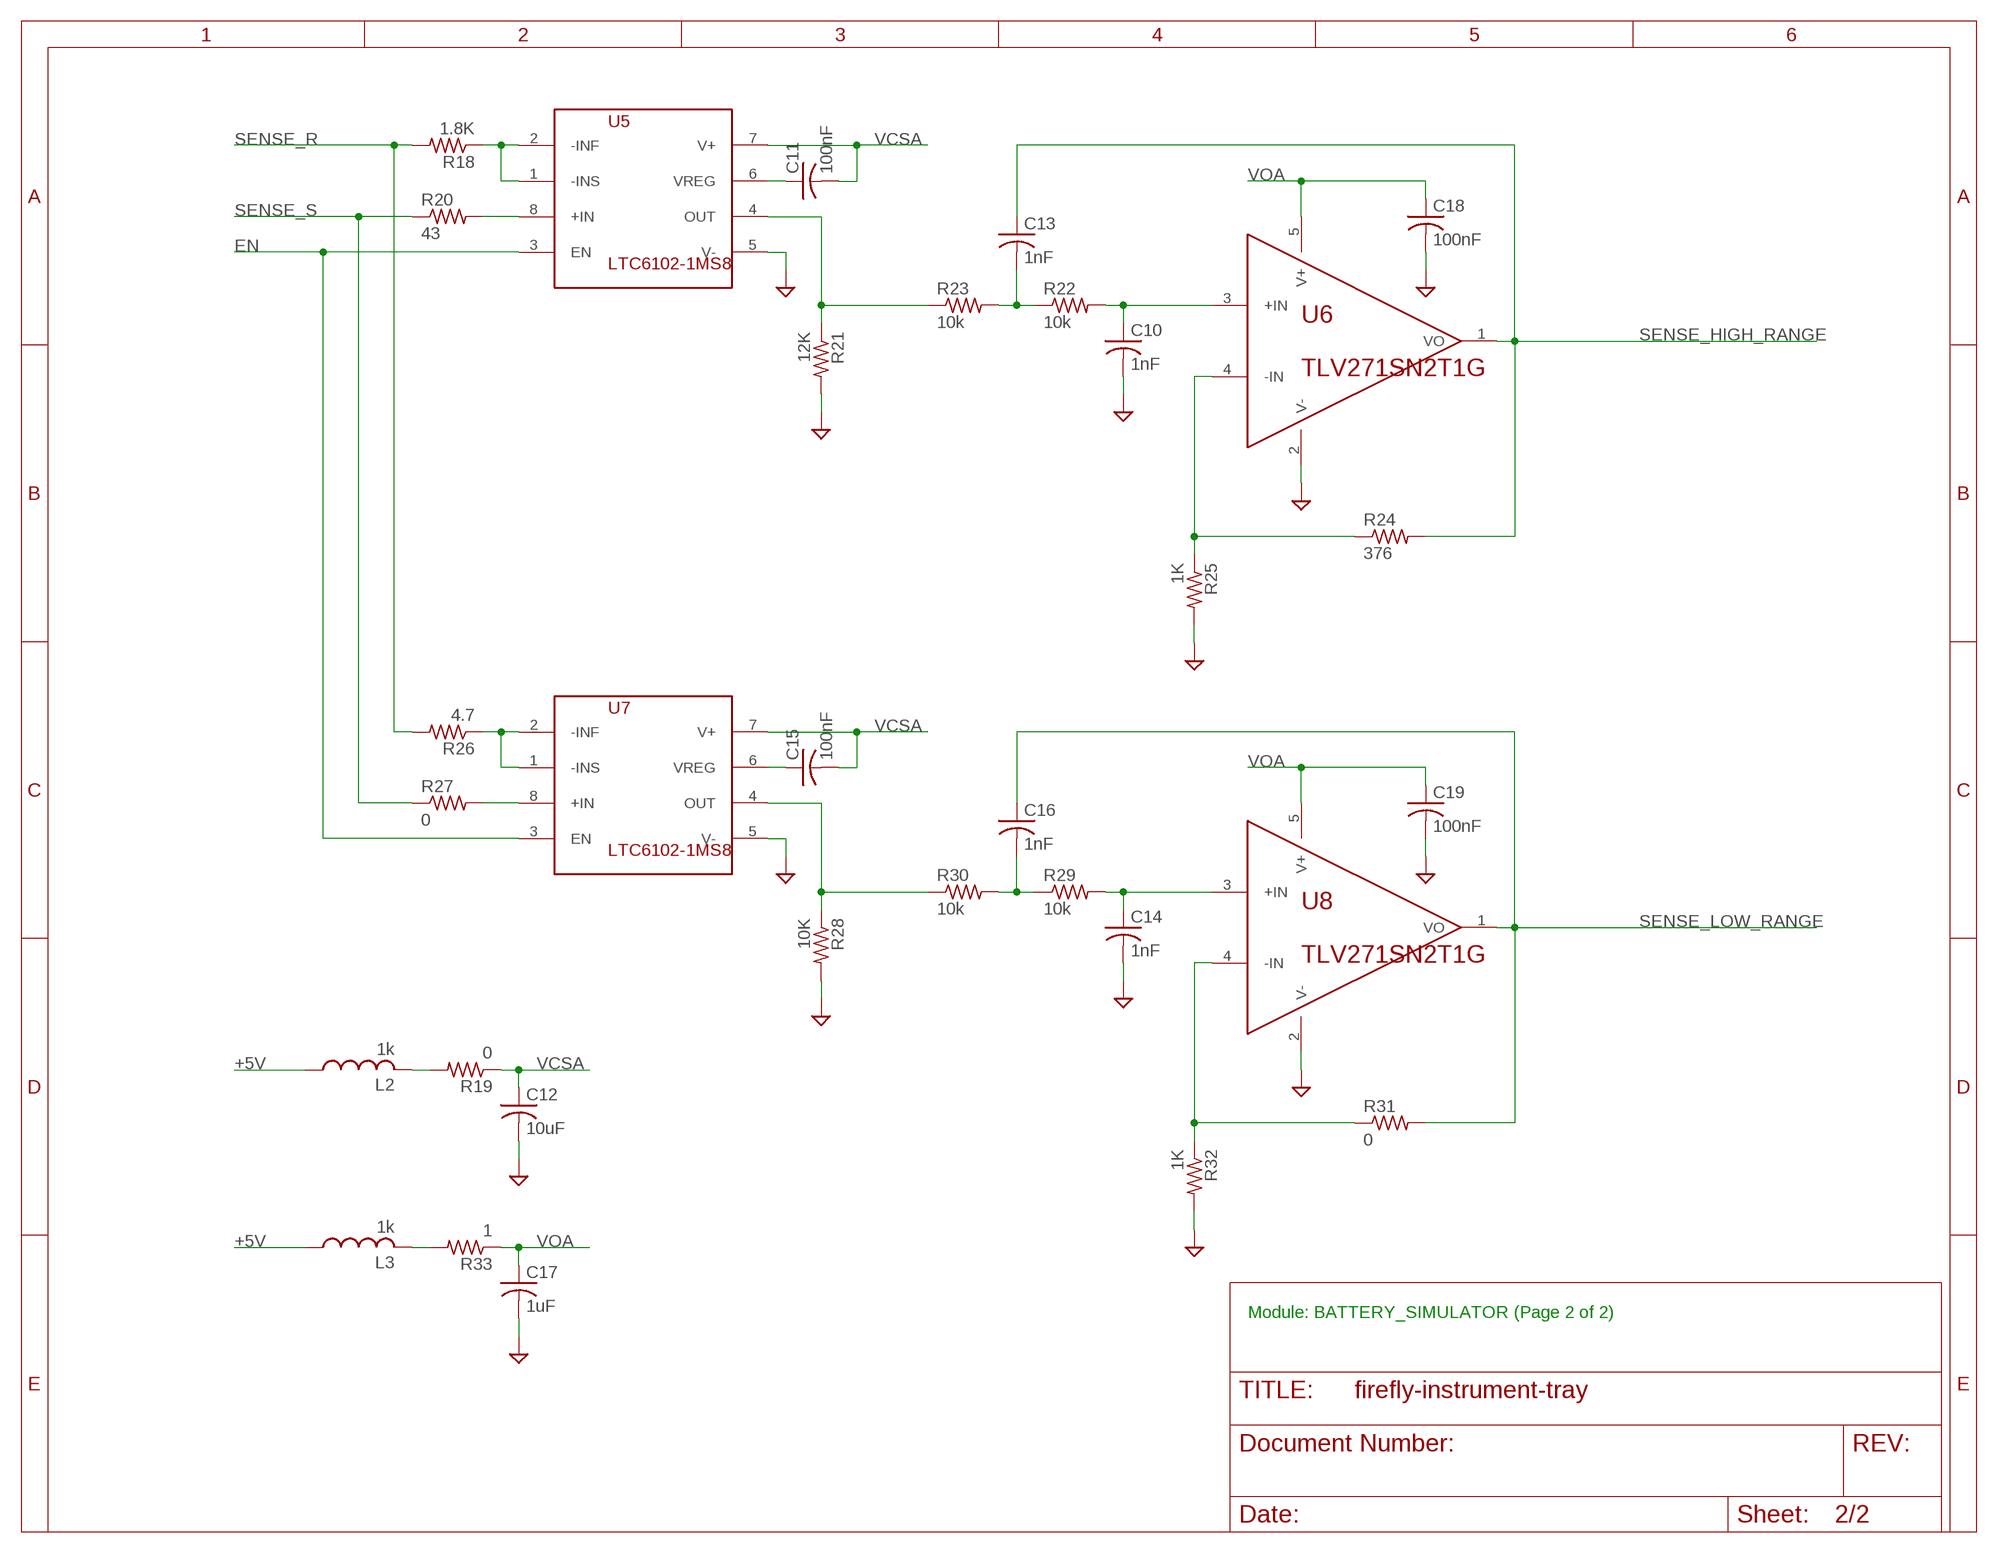
[diagram p6: schematic, module BATTERY_SIMULATOR, sheet 2]

#### Parts
C10  1nF  C-USC0805  [C0805]
C11  100nF  C-USC0805  [C0805]
C12  10uF  C-USC0805  [C0805]
C13  1nF  C-USC0805  [C0805]
C14  1nF  C-USC0805  [C0805]
C15  100nF  C-USC0805  [C0805]
C16  1nF  C-USC0805  [C0805]
C17  1uF  C-USC0805  [C0805]
C18  100nF  C-USC0805  [C0805]
C19  100nF  C-USC0805  [C0805]
L2  1k  L-USL2012C  [L2012C]
L3  1k  L-USL2012C  [L2012C]
R18  1.8K  R-USR0805  [R0805]
R19  0  R-USR0805  [R0805]
R20  43  R-USR0805  [R0805]
R21  12K  R-USR0805  [R0805]
R22  10k  R-USR0805  [R0805]
R23  10k  R-USR0805  [R0805]
R24  376  R-USR0805  [R0805]
R25  1K  R-USR0805  [R0805]
R26  4.7  R-USR0805  [R0805]
R27  0  R-USR0805  [R0805]
R28  10K  R-USR0805  [R0805]
R29  10k  R-USR0805  [R0805]
R30  10k  R-USR0805  [R0805]
R31  0  R-USR0805  [R0805]
R32  1K  R-USR0805  [R0805]
R33  1  R-USR0805  [R0805]
U5  LTC6102-1MS8  [MSOP8]
U6  TLV271SN2T1G  [SOT-23-5]
U7  LTC6102-1MS8  [MSOP8]
U8  TLV271SN2T1G  [SOT-23-5]

#### Nets
+5V: L2.1 L3.1 ; also sheet 1
EN: U5.3(EN) U7.3(EN) ; also sheet 1
GND: C10.2 C12.2 C14.2 C17.2 C18.2 C19.2 R21.2 R25.2 R28.2 R32.2 U5.5(V-) U6.2(V-) U7.5(V-) U8.2(V-) ; also sheet 1
N$13: L2.2 R19.2
N$14: C11.1 U5.6(VREG)
N$15: R18.1 U5.1(-INS) U5.2(-INF)
N$16: R20.2 U5.8(+IN)
N$17: R21.1 R23.1 U5.4(OUT)
N$18: C13.2 R22.1 R23.2
N$19: C10.1 R22.2 U6.3(+IN)
N$20: R24.1 R25.1 U6.4(-IN)
N$21: C15.1 U7.6(VREG)
N$22: R26.1 U7.1(-INS) U7.2(-INF)
N$23: R27.2 U7.8(+IN)
N$24: R28.1 R30.1 U7.4(OUT)
N$25: C16.2 R29.1 R30.2
N$26: C14.1 R29.2 U8.3(+IN)
N$27: R31.1 R32.1 U8.4(-IN)
N$28: L3.2 R33.2
SENSE_HIGH_RANGE: C13.1 R24.2 U6.1(VO)
SENSE_LOW_RANGE: C16.1 R31.2 U8.1(VO)
SENSE_R: R18.2 R26.2 ; also sheet 1
SENSE_S: R20.1 R27.1 ; also sheet 1
VCSA: C11.2 C12.1 C15.2 R19.1 U5.7(V+) U7.7(V+)
VOA: C17.1 C18.1 C19.1 R33.1 U6.5(V+) U8.5(V+)

#### Notes on the sheet
- Module: BATTERY_SIMULATOR (Page 2 of 2)

### Library data of the parts
C4 C5 C17 = firefly:C-US: CAPACITOR, American symbol; MANUFACTURER: Yageo; ORDERING-CODE: CC0805KKX7R7BB105
C10 C14 = firefly:C-US: CAPACITOR, American symbol; MANUFACTURER: AVX Corporation; ORDERING-CODE: 08055A102JAT2A
C11 C15 C18 C19 = firefly:C-US: CAPACITOR, American symbol; MANUFACTURER: AVX Corporation; ORDERING-CODE: 08055C104KAT2A
C12 = firefly:C-US: CAPACITOR, American symbol; MANUFACTURER: AVX Corporation; ORDERING-CODE: 0805YD106KAT2A
C13 C16 = firefly:C-US: CAPACITOR, American symbol; ORDERING-CODE: 08055A102JAT2A
L2 L3 = firefly:L-US: INDUCTOR, American symbol; MANUFACTURER: Murata Electronics; ORDERING-CODE: BLM21BD102SN1D
R1 R2 R12 R13 = firefly:R-US: RESISTOR, American symbol; MANUFACTURER: Yageo; ORDERING-CODE: RC0805FR-07100KL
R11 = firefly:R-US: RESISTOR, American symbol; MANUFACTURER: Yageo; ORDERING-CODE: RC0805FR-07649KL
R18 = firefly:R-US: RESISTOR, American symbol; MANUFACTURER: Yageo; ORDERING-CODE: RC0805FR-071K8L
R19 R27 R31 R34 R35 = firefly:R-US: RESISTOR, American symbol; MANUFACTURER: Yageo; ORDERING-CODE: RC0805FR-070RL
R20 = firefly:R-US: RESISTOR, American symbol; MANUFACTURER: Yageo; ORDERING-CODE: RC0805FR-0743RL
R21 = firefly:R-US: RESISTOR, American symbol; MANUFACTURER: Yageo; ORDERING-CODE: RC0805FR-0712KL
R22 R23 R25 R28-R30 R32 = firefly:R-US: RESISTOR, American symbol; MANUFACTURER: Yageo; ORDERING-CODE: RC0805FR-0710KL
R24 = firefly:R-US: RESISTOR, American symbol; MANUFACTURER: Yageo; ORDERING-CODE: RC0805FR-07374RL
R26 RS = firefly:R-US: RESISTOR, American symbol; MANUFACTURER: Yageo; ORDERING-CODE: RC0805FR-074R7L
R33 = firefly:R-US: RESISTOR, American symbol; MANUFACTURER: Yageo; ORDERING-CODE: RC0805FR-071RL
U2 = firefly:VREG-ADJ; MANUFACTURER: Diodes Incorporated; ORDERING-CODE: AP7331-WG-7
U5 U7 = firefly:LTC6102-1; MANUFACTURER: Linear Technology; ORDERING-CODE: LTC6102CMS8-1#PBF
U6 U8 = firefly:TLV271SN2T1G; MANUFACTURER: ON Semiconductor; ORDERING-CODE: TLV271SN2T1G

## Module COLOR_SENSOR
Ports: INT(io) SCL(io) SDA(io) GND(io) +3V3(io)
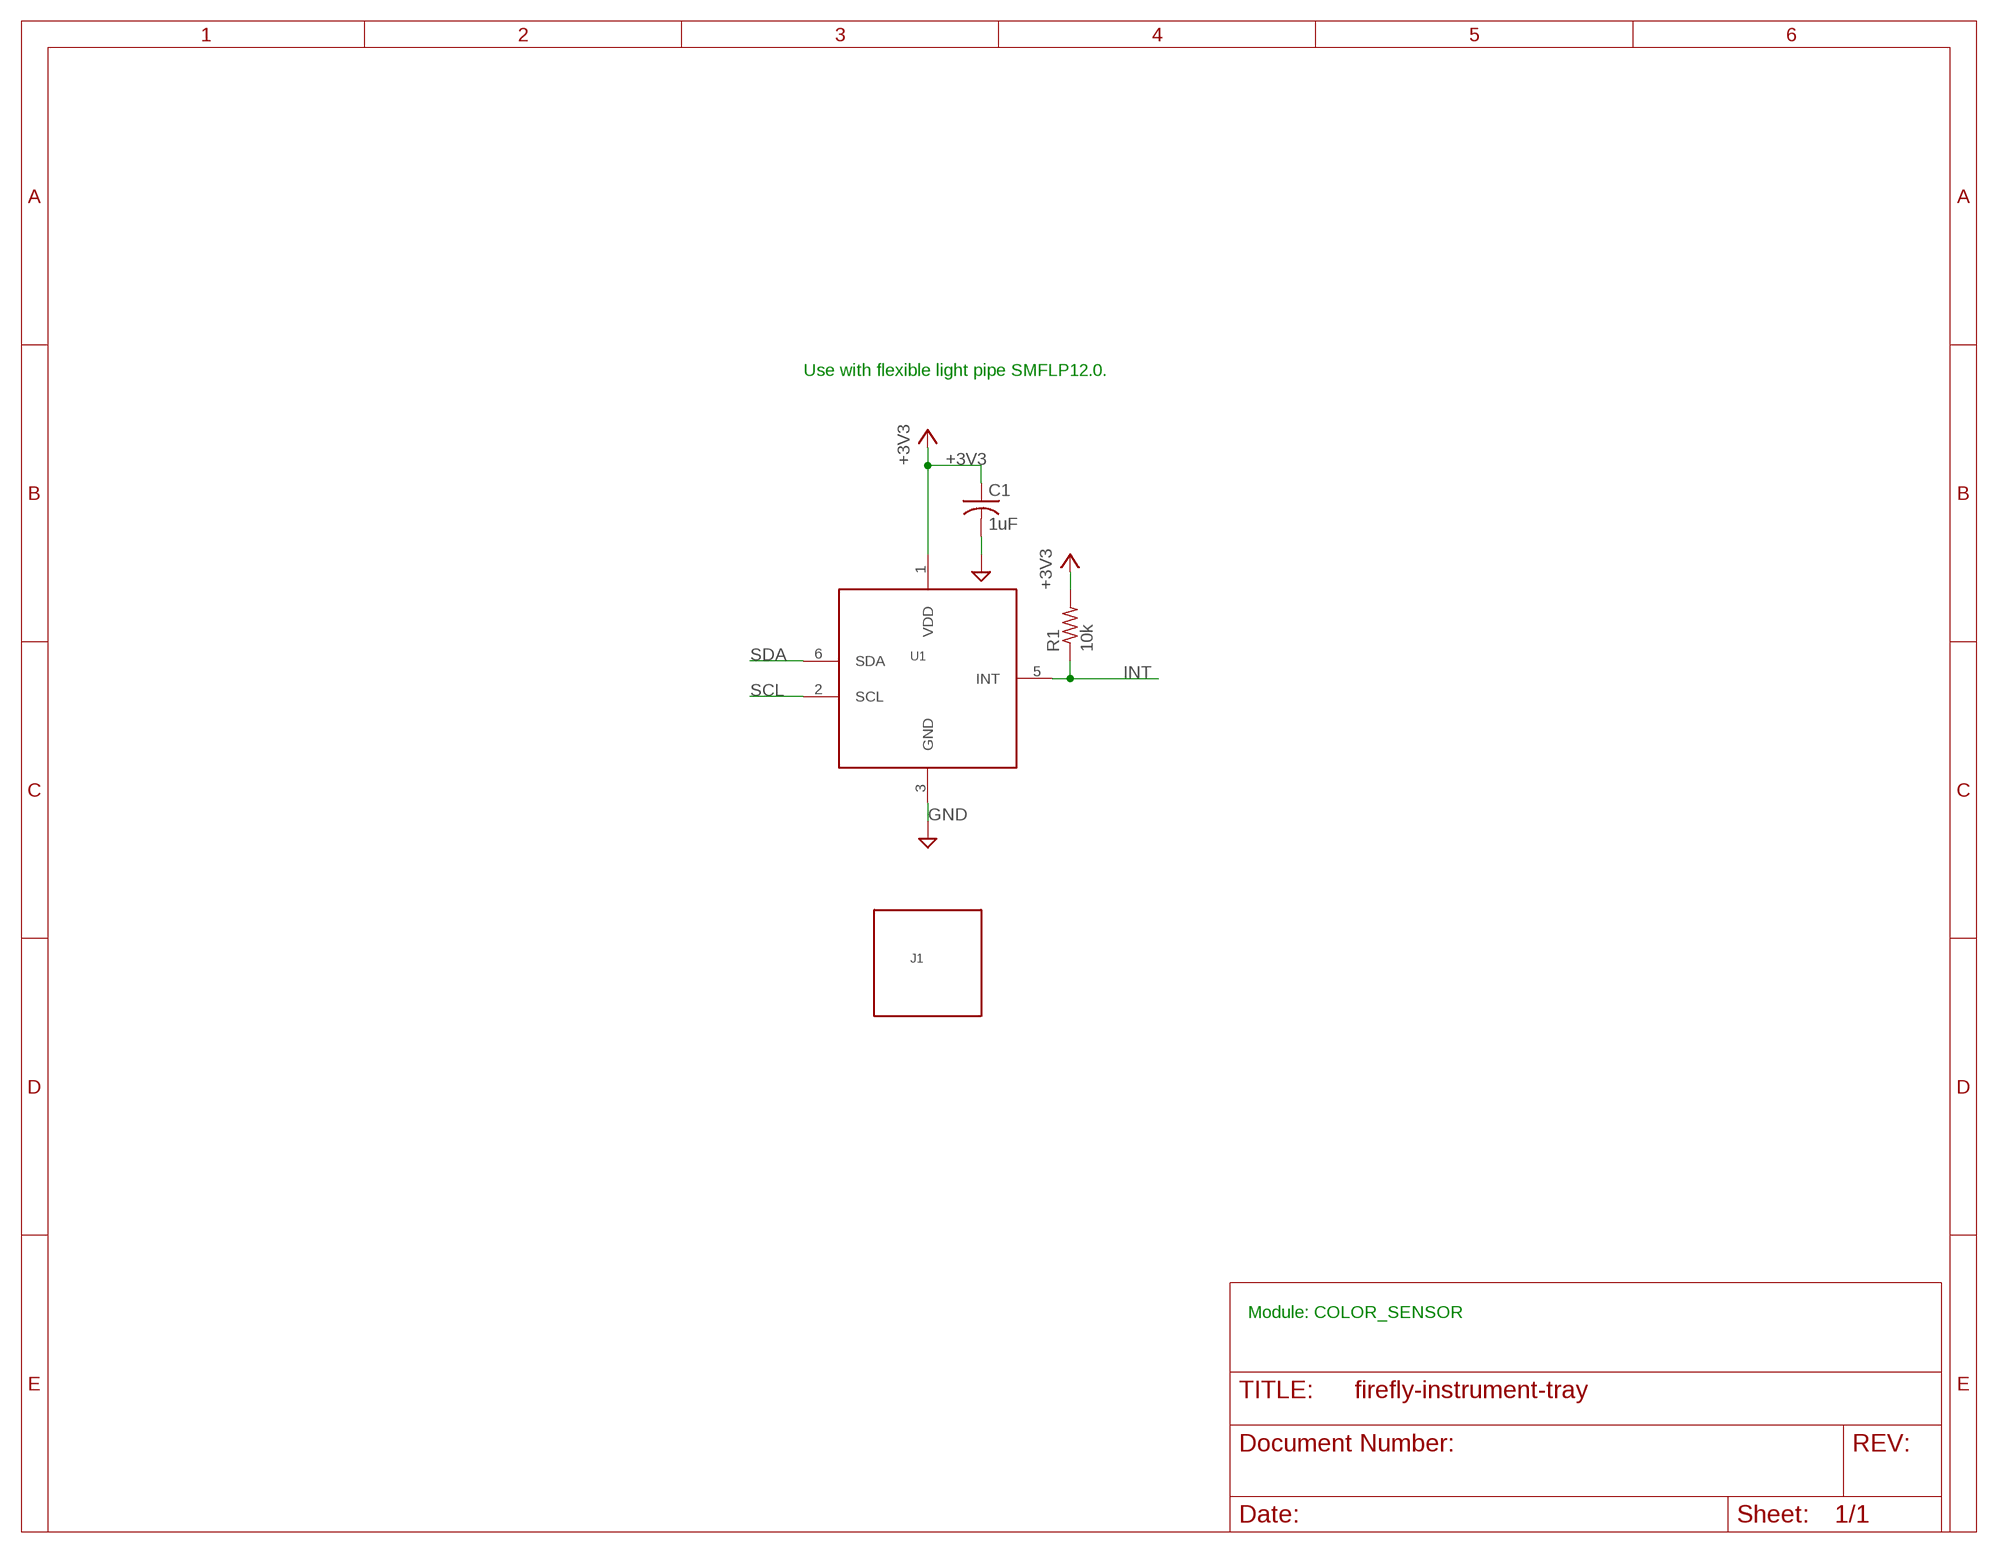
[diagram p7: schematic, module COLOR_SENSOR, sheet 1]

### Parts
C1  1uF  C-USC0805  [C0805]
J1  SMFLP  [SMFLP]
R1  10k  R-USR0805  [R0805]
U1  TCS3471  [DFN6]

### Nets
+3V3: C1.1 R1.2 U1.1(VDD)
GND: C1.2 U1.3(GND)
INT: R1.1 U1.5(INT)
SCL: U1.2(SCL)
SDA: U1.6(SDA)

### Notes on the sheet
- Use with flexible light pipe SMFLP12.0.
- Module: COLOR_SENSOR

### Library data of the parts
C1 = firefly:C-US: CAPACITOR, American symbol; MANUFACTURER: Yageo; ORDERING-CODE: CC0805KKX7R7BB105
J1 = firefly:SMFLP; MANUFACTURER: Bivar Inc.; ORDERING-CODE: SMFLP12.0
R1 = firefly:R-US: RESISTOR, American symbol; MANUFACTURER: Yageo; ORDERING-CODE: RC0805FR-0710KL
U1 = firefly:TCS3471; MANUFACTURER: AMS-TAOS USA Inc.; ORDERING-CODE: TCS34715FN